# Altium project FlightController.PrjPcb (part 1 of 2)
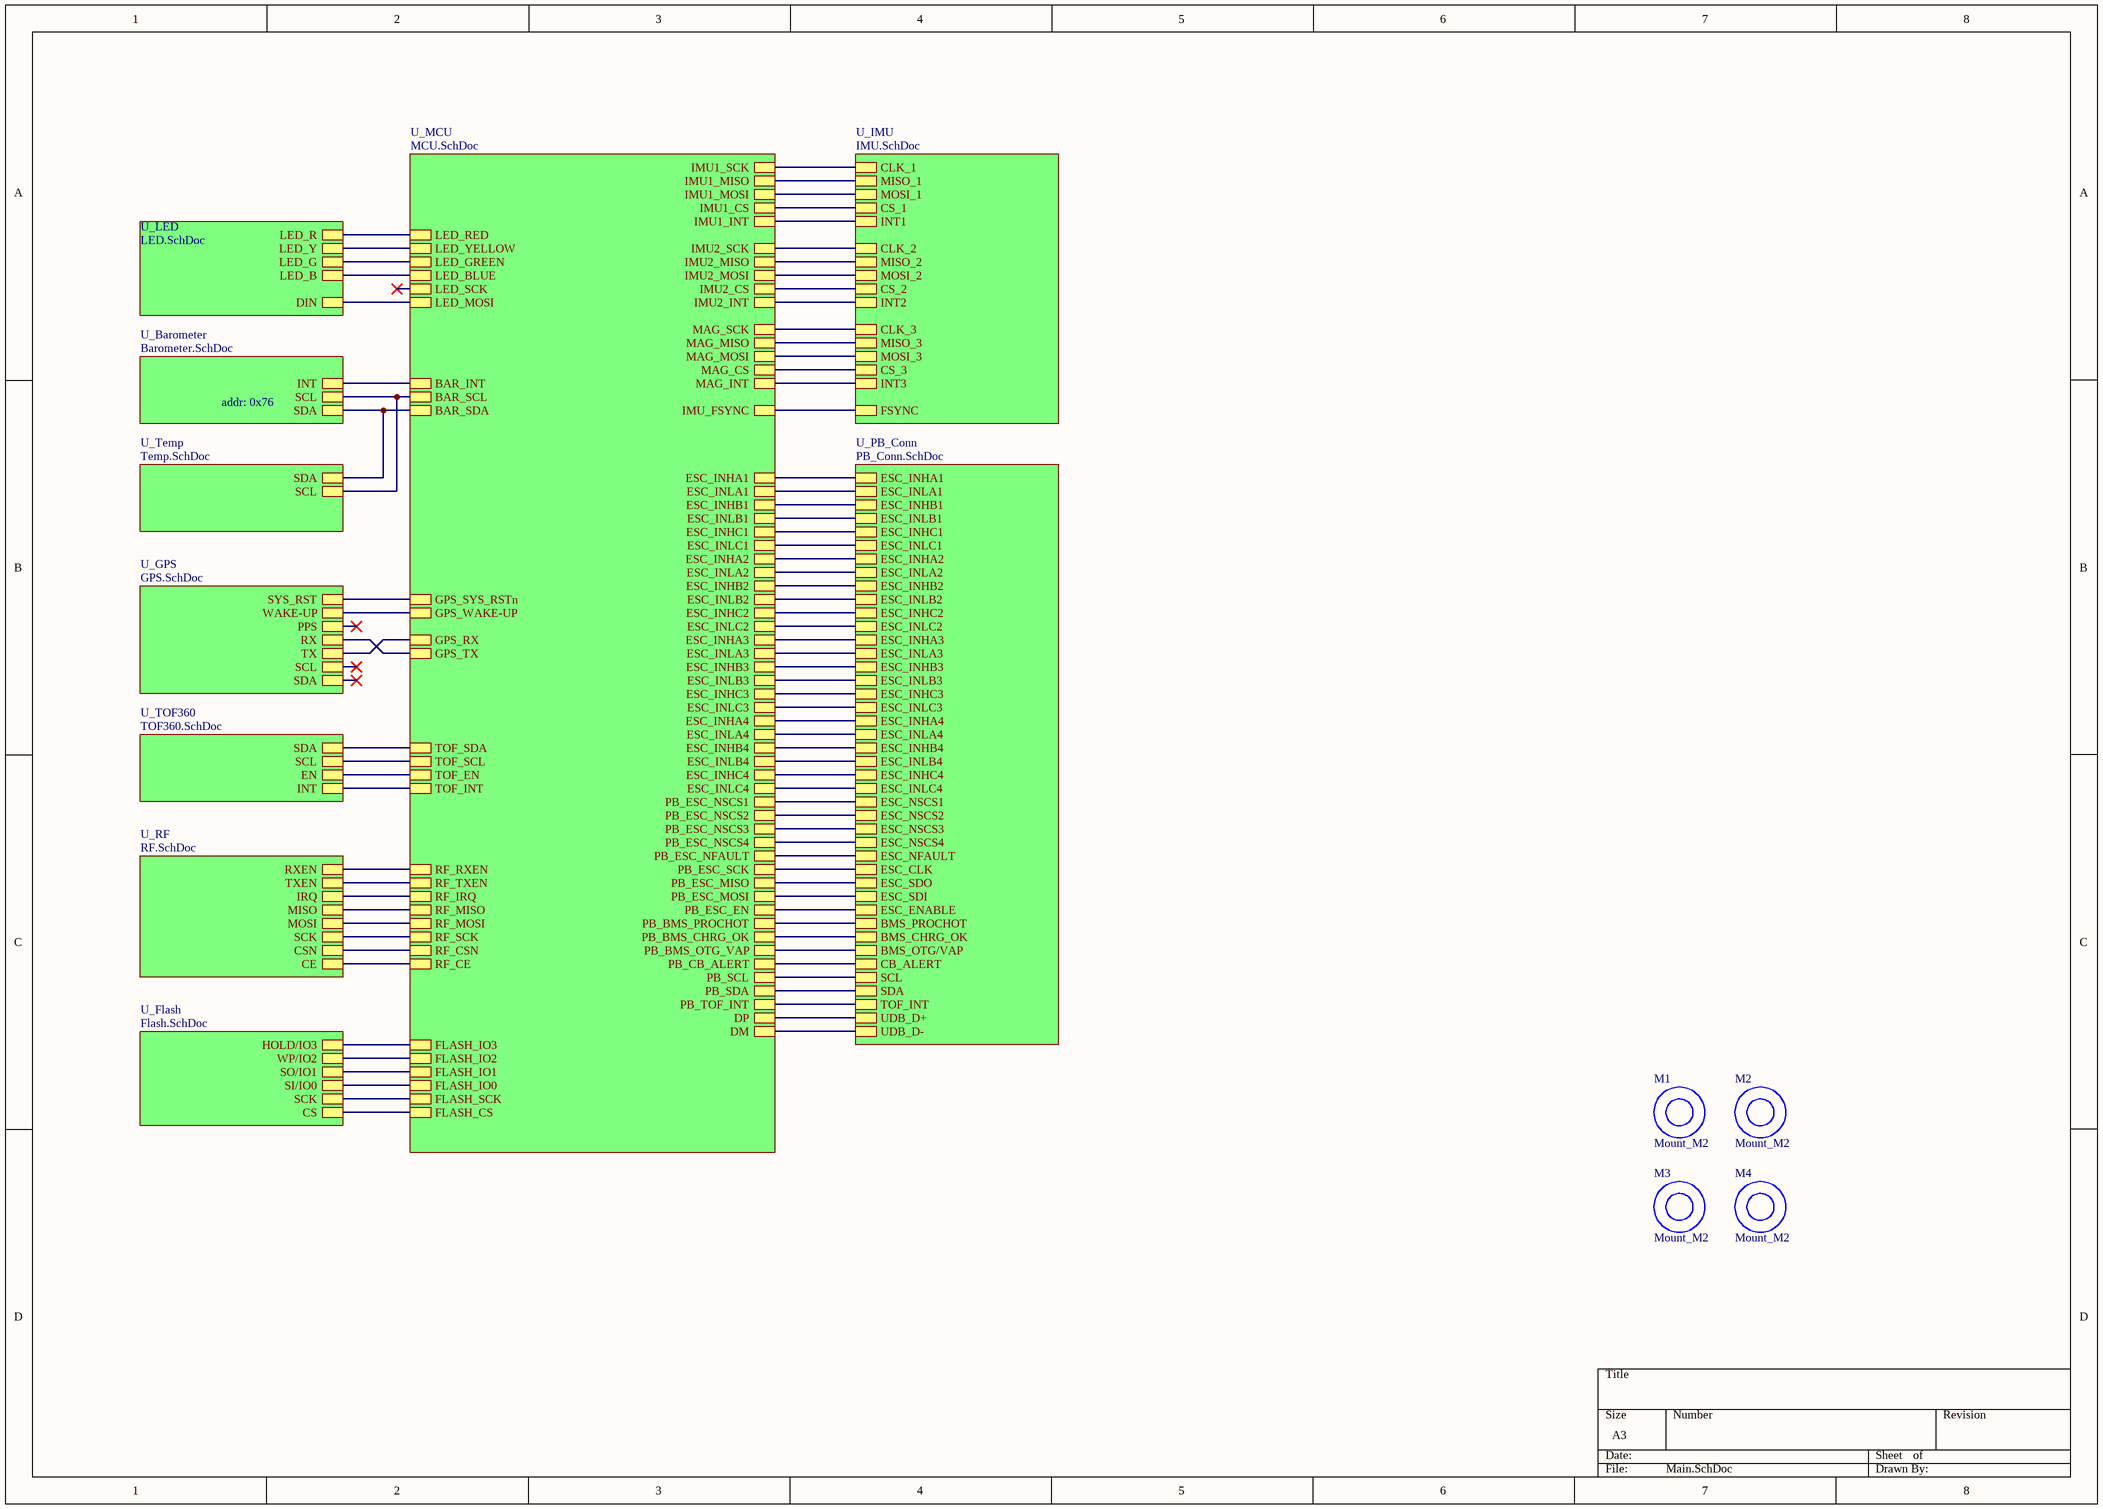
[diagram p0: Main.SchDoc]
11 sheets, 177 parts. Net scope: hierarchical (ports join the sheet entries above them; power ports are global).
Board file: PCB.PcbDoc
Sheets:
  Main.SchDoc
    U_MCU = MCU.SchDoc
    U_IMU = IMU.SchDoc
    U_Flash = Flash.SchDoc
    U_GPS = GPS.SchDoc
    U_Barometer = Barometer.SchDoc
    U_LED = LED.SchDoc
    U_PB_Conn = PB_Conn.SchDoc
      U_PSU = PSU.SchDoc
    U_Temp = Temp.SchDoc
  NRF24l01.SchDoc

## Sheet Main.SchDoc
size A3; SheetNumber: 1; SheetTotal: 13

### Parts
M1  Mount_M2  [Mount_M2_anti_vibration_rubber]
M2  Mount_M2  [Mount_M2_anti_vibration_rubber]
M3  Mount_M2  [Mount_M2_anti_vibration_rubber]
M4  Mount_M2  [Mount_M2_anti_vibration_rubber]

### Sub-sheets
U_Barometer = Barometer.SchDoc: SDA, SCL, INT
U_Flash = Flash.SchDoc: CS, SO/IO1, WP/IO2, HOLD/IO3, SCK, SI/IO0
U_GPS = GPS.SchDoc: SDA, SCL, TX, RX, PPS, WAKE-UP, SYS_RST
U_IMU = IMU.SchDoc: INT1, INT2, MISO_1, MOSI_1, CS_1, CLK_1, FSYNC, MISO_2, MOSI_2, CS_2, CLK_2, MOSI_3, CS_3, CLK_3, MISO_3, INT3
U_LED = LED.SchDoc: DIN, LED_R, LED_G, LED_Y, LED_B
U_MCU = MCU.SchDoc: DP, DM, TOF_SDA, TOF_SCL, TOF_EN, TOF_INT, ESC_INHA1, ESC_INHA2, ESC_INHA3, ESC_INHA4, ESC_INHB1, ESC_INHC1, ESC_INHB2, ESC_INHB3, ESC_INHB4, ESC_INHC2, ESC_INHC3, ESC_INHC4, ESC_INLA1, ESC_INLB1, ESC_INLC1, ESC_INLA2, ESC_INLA3, ESC_INLA4, ESC_INLB2, ESC_INLB3, ESC_INLB4, ESC_INLC2, ESC_INLC3, ESC_INLC4, RF_IRQ, RF_CSN, RF_MOSI, RF_MISO, RF_SCK, RF_CE, RF_RXEN, RF_TXEN, PB_SCL, PB_SDA, PB_TOF_INT, PB_ESC_EN, PB_ESC_SCK, PB_ESC_MISO, PB_ESC_MOSI, PB_ESC_NSCS1, PB_ESC_NSCS2, PB_ESC_NSCS3, PB_ESC_NSCS4, PB_BMS_PROCHOT, PB_BMS_OTG_VAP, PB_BMS_CHRG_OK, PB_CB_ALERT, PB_ESC_NFAULT, FLASH_IO0, FLASH_IO1, FLASH_IO2, FLASH_IO3, FLASH_SCK, FLASH_CS, GPS_RX, GPS_TX, GPS_WAKE-UP, GPS_SYS_RSTn, BAR_SCL, BAR_SDA, BAR_INT, LED_MOSI, LED_SCK, LED_RED, LED_GREEN, IMU1_SCK, IMU1_MISO, IMU1_MOSI, IMU1_CS, IMU1_INT, IMU2_INT, IMU2_SCK, IMU2_MISO, IMU2_MOSI, IMU2_CS, MAG_SCK, MAG_MISO, MAG_MOSI, MAG_CS, MAG_INT, IMU_FSYNC, LED_YELLOW, LED_BLUE
U_PB_Conn = PB_Conn.SchDoc: ESC_INLA1, ESC_INLB1, ESC_INLC1, ESC_INLA2, ESC_INLB2, ESC_INLC2, ESC_INLA3, ESC_INLB3, ESC_INLC3, ESC_INHA4, ESC_INLB4, ESC_INLC4, ESC_NSCS1, ESC_INHA1, ESC_INHB1, ESC_INHC1, ESC_INHA2, ESC_INHB2, ESC_INHC2, ESC_INHA3, ESC_INHB3, ESC_INHC3, ESC_INLA4, ESC_INHB4, ESC_INHC4, ESC_NSCS2, ESC_NSCS3, ESC_NSCS4, ESC_NFAULT, ESC_CLK, ESC_SDO, ESC_SDI, ESC_ENABLE, BMS_PROCHOT, BMS_CHRG_OK, BMS_OTG/VAP, CB_ALERT, SCL, SDA, TOF_INT, UDB_D+, UDB_D-
U_RF = RF.SchDoc (file not in this document): CE, CSN, SCK, MOSI, MISO, IRQ, TXEN, RXEN
U_Temp = Temp.SchDoc: SDA, SCL
U_TOF360 = TOF360.SchDoc (file not in this document): INT, SCL, SDA, EN

### Nets
I2C1_SCL: sheet U_MCU/TOF_SCL, sheet U_TOF360/SCL
I2C1_SDA: sheet U_MCU/TOF_SDA, sheet U_TOF360/SDA
SPI1_MISO: sheet U_MCU/IMU1_MISO, sheet U_IMU/MISO_1
SPI1_MOSI: sheet U_MCU/IMU1_MOSI, sheet U_IMU/MOSI_1
SPI1_SCK: sheet U_MCU/IMU1_SCK, sheet U_IMU/CLK_1
SPI5_MISO: sheet U_MCU/MAG_MISO, sheet U_IMU/MISO_3
SPI5_MOSI: sheet U_MCU/MAG_MOSI, sheet U_IMU/MOSI_3
SPI5_SCK: sheet U_MCU/MAG_SCK, sheet U_IMU/CLK_3
SPI6_MISO: sheet U_MCU/IMU2_MISO, sheet U_IMU/MISO_2
SPI6_MOSI: sheet U_MCU/IMU2_MOSI, sheet U_IMU/MOSI_2
SPI6_SCK: sheet U_MCU/IMU2_SCK, sheet U_IMU/CLK_2
TOF_EN: sheet U_MCU/TOF_EN, sheet U_TOF360/EN
TOF_INT: sheet U_MCU/TOF_INT, sheet U_TOF360/INT
NetC84_2: sheet U_MCU/GPS_TX, sheet U_GPS/RX
NetC85_2: sheet U_MCU/GPS_RX, sheet U_GPS/TX
NetD6_3: sheet U_MCU/LED_MOSI, sheet U_LED/DIN
NetIC1_4: sheet U_MCU/IMU1_INT, sheet U_IMU/INT1
NetIC1_9: sheet U_MCU/IMU_FSYNC, sheet U_IMU/FSYNC
NetIC1_12: sheet U_MCU/IMU1_CS, sheet U_IMU/CS_1
NetIC2_4: sheet U_MCU/IMU2_INT, sheet U_IMU/INT2
NetIC2_12: sheet U_MCU/IMU2_CS, sheet U_IMU/CS_2
NetIC3_1: sheet U_MCU/MAG_INT, sheet U_IMU/INT3
NetIC3_2: sheet U_MCU/MAG_CS, sheet U_IMU/CS_3
NetIC4_10: sheet U_MCU/ESC_INHC3, sheet U_PB_Conn/ESC_INHC3
NetIC4_11: sheet U_MCU/ESC_INHB3, sheet U_PB_Conn/ESC_INHB3
NetIC4_12: sheet U_MCU/ESC_INHA3, sheet U_PB_Conn/ESC_INHA3
NetIC4_28: sheet U_MCU/PB_ESC_MISO, sheet U_PB_Conn/ESC_SDO
NetIC4_29: sheet U_MCU/PB_ESC_MOSI, sheet U_PB_Conn/ESC_SDI
NetIC4_34: sheet U_MCU/ESC_INHC4, sheet U_PB_Conn/ESC_INHC4
NetIC4_35: sheet U_MCU/ESC_INHB4, sheet U_PB_Conn/ESC_INHB4
NetIC4_36: sheet U_MCU/ESC_INHA4, sheet U_PB_Conn/ESC_INHA4
NetIC4_37: sheet U_MCU/FLASH_IO2, sheet U_Flash/WP/IO2
NetIC4_42: sheet U_MCU/FLASH_IO3, sheet U_Flash/HOLD/IO3
NetIC4_45: sheet U_MCU/PB_ESC_NFAULT, sheet U_PB_Conn/ESC_NFAULT
NetIC4_46: sheet U_MCU/FLASH_IO1, sheet U_Flash/SO/IO1
NetIC4_47: sheet U_MCU/FLASH_IO0, sheet U_Flash/SI/IO0
NetIC4_48: sheet U_MCU/FLASH_SCK, sheet U_Flash/SCK
NetIC4_49: sheet U_MCU/GPS_SYS_RSTn, sheet U_GPS/SYS_RST
NetIC4_50: sheet U_MCU/GPS_WAKE-UP, sheet U_GPS/WAKE-UP
NetIC4_53: sheet U_MCU/PB_ESC_EN, sheet U_PB_Conn/ESC_ENABLE
NetIC4_54: sheet U_MCU/BAR_SCL, sheet U_Barometer/SCL, sheet U_Temp/SCL
NetIC4_55: sheet U_MCU/BAR_SDA, sheet U_Barometer/SDA, sheet U_Temp/SDA
NetIC4_58: sheet U_MCU/PB_ESC_NSCS4, sheet U_PB_Conn/ESC_NSCS4
NetIC4_59: sheet U_MCU/ESC_INLA4, sheet U_PB_Conn/ESC_INLA4
NetIC4_60: sheet U_MCU/ESC_INLB4, sheet U_PB_Conn/ESC_INLB4
NetIC4_63: sheet U_MCU/ESC_INLC4, sheet U_PB_Conn/ESC_INLC4
NetIC4_64: sheet U_MCU/FLASH_CS, sheet U_Flash/CS
NetIC4_65: sheet U_MCU/PB_ESC_NSCS3, sheet U_PB_Conn/ESC_NSCS3
NetIC4_66: sheet U_MCU/ESC_INLA3, sheet U_PB_Conn/ESC_INLA3
NetIC4_67: sheet U_MCU/ESC_INLB3, sheet U_PB_Conn/ESC_INLB3
NetIC4_68: sheet U_MCU/ESC_INLC3, sheet U_PB_Conn/ESC_INLC3
NetIC4_69: sheet U_MCU/PB_SCL, sheet U_PB_Conn/SCL
NetIC4_70: sheet U_MCU/PB_SDA, sheet U_PB_Conn/SDA
NetIC4_73: sheet U_MCU/PB_ESC_NSCS1, sheet U_PB_Conn/ESC_NSCS1
NetIC4_74: sheet U_MCU/PB_ESC_SCK, sheet U_PB_Conn/ESC_CLK
NetIC4_75: sheet U_MCU/BAR_INT, sheet U_Barometer/INT
NetIC4_76: sheet U_MCU/ESC_INLA1, sheet U_PB_Conn/ESC_INLA1
NetIC4_77: sheet U_MCU/ESC_INLB1, sheet U_PB_Conn/ESC_INLB1
NetIC4_78: sheet U_MCU/PB_BMS_OTG_VAP, sheet U_PB_Conn/BMS_OTG/VAP
NetIC4_79: sheet U_MCU/ESC_INLC1, sheet U_PB_Conn/ESC_INLC1
NetIC4_80: sheet U_MCU/PB_ESC_NSCS2, sheet U_PB_Conn/ESC_NSCS2
NetIC4_81: sheet U_MCU/ESC_INHC1, sheet U_PB_Conn/ESC_INHC1
NetIC4_82: sheet U_MCU/ESC_INHB1, sheet U_PB_Conn/ESC_INHB1
NetIC4_85: sheet U_MCU/ESC_INHA1, sheet U_PB_Conn/ESC_INHA1
NetIC4_86: sheet U_MCU/PB_BMS_PROCHOT, sheet U_PB_Conn/BMS_PROCHOT
NetIC4_87: sheet U_MCU/PB_TOF_INT, sheet U_PB_Conn/TOF_INT
NetIC4_88: sheet U_MCU/ESC_INLC2, sheet U_PB_Conn/ESC_INLC2
NetIC4_89: sheet U_MCU/ESC_INLB2, sheet U_PB_Conn/ESC_INLB2
NetIC4_90: sheet U_MCU/ESC_INLA2, sheet U_PB_Conn/ESC_INLA2
NetIC4_92: sheet U_MCU/PB_BMS_CHRG_OK, sheet U_PB_Conn/BMS_CHRG_OK
NetIC4_93: sheet U_MCU/PB_CB_ALERT, sheet U_PB_Conn/CB_ALERT
NetIC4_96: sheet U_MCU/ESC_INHA2, sheet U_PB_Conn/ESC_INHA2
NetIC4_97: sheet U_MCU/ESC_INHB2, sheet U_PB_Conn/ESC_INHB2
NetIC4_98: sheet U_MCU/ESC_INHC2, sheet U_PB_Conn/ESC_INHC2
NetIC4_99: sheet U_MCU/LED_BLUE, sheet U_LED/LED_B
NetIC4_100: sheet U_MCU/LED_GREEN, sheet U_LED/LED_G
NetIC4_101: sheet U_MCU/LED_YELLOW, sheet U_LED/LED_Y
NetIC4_102: sheet U_MCU/LED_RED, sheet U_LED/LED_R
NetIC4_103: sheet U_MCU/DM, sheet U_PB_Conn/UDB_D-
NetIC4_104: sheet U_MCU/DP, sheet U_PB_Conn/UDB_D+
NetIC4_110: sheet U_MCU/RF_CE, sheet U_RF/CE
NetIC4_111: sheet U_MCU/RF_SCK, sheet U_RF/SCK
NetIC4_112: sheet U_MCU/RF_MISO, sheet U_RF/MISO
NetIC4_113: sheet U_MCU/RF_MOSI, sheet U_RF/MOSI
NetIC4_114: sheet U_MCU/RF_CSN, sheet U_RF/CSN
NetIC4_115: sheet U_MCU/RF_IRQ, sheet U_RF/IRQ
NetIC4_116: sheet U_MCU/RF_TXEN, sheet U_RF/TXEN
NetIC4_118: sheet U_MCU/RF_RXEN, sheet U_RF/RXEN

### Notes on the sheet
- addr: 0x76

## Sheet MCU.SchDoc
size A2; SheetNumber: 3; SheetTotal: 13
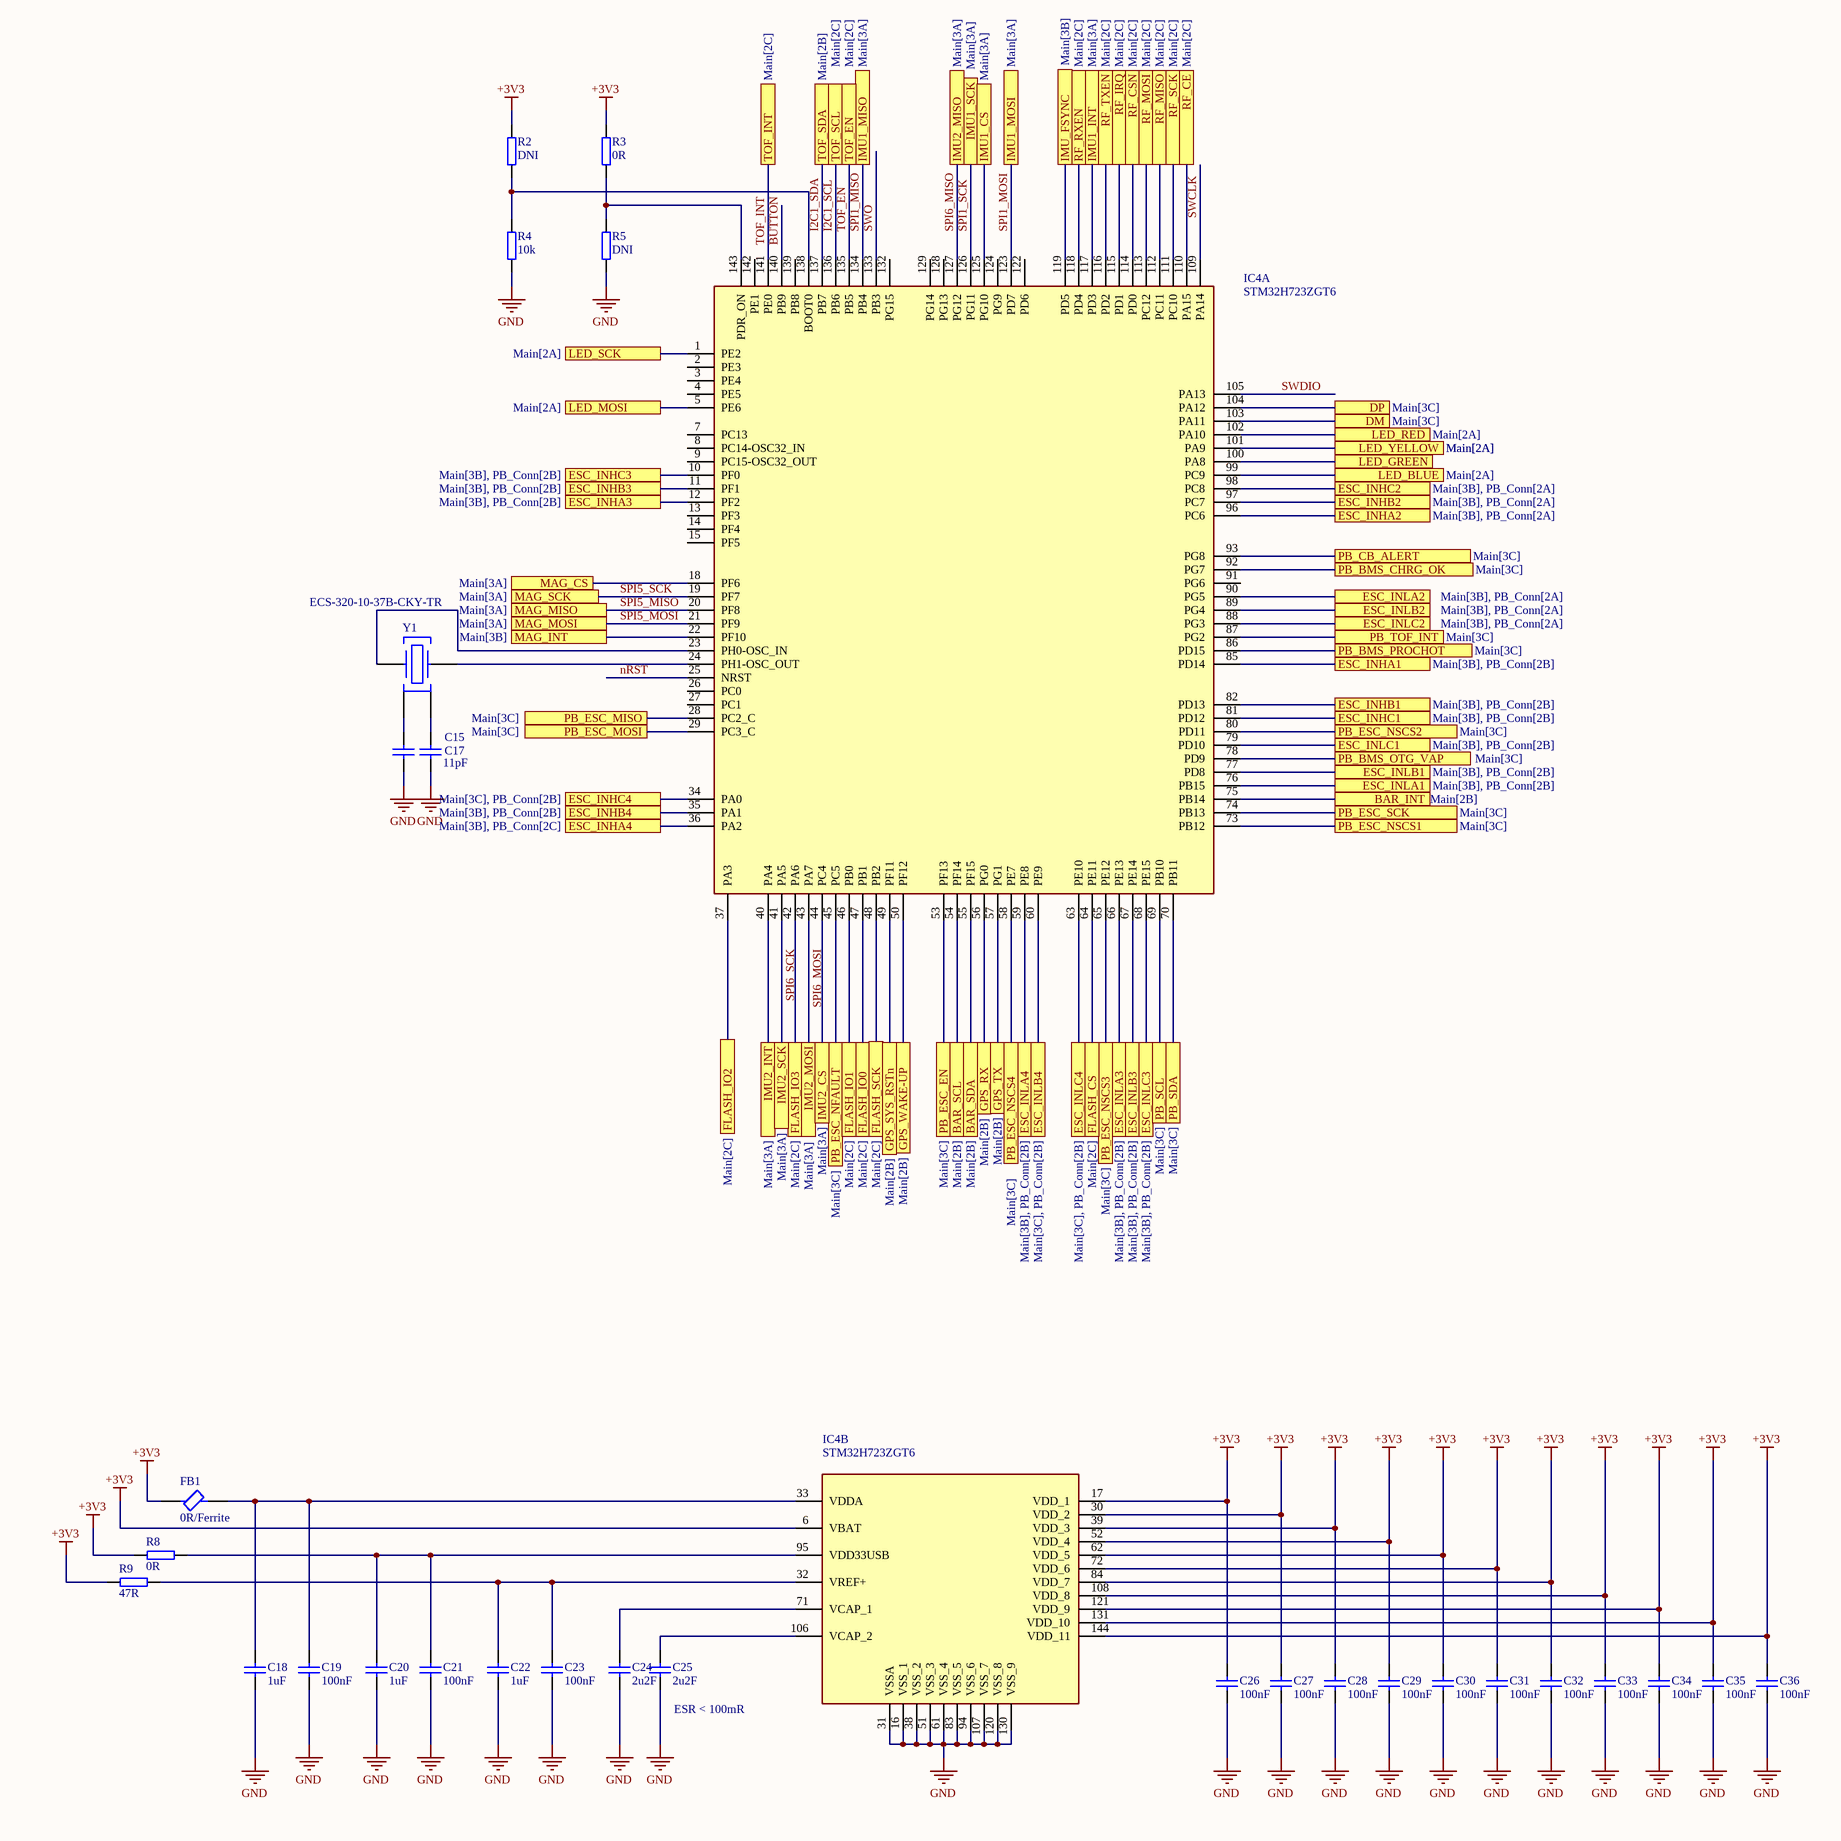
[diagram p1: MCU.SchDoc, left]
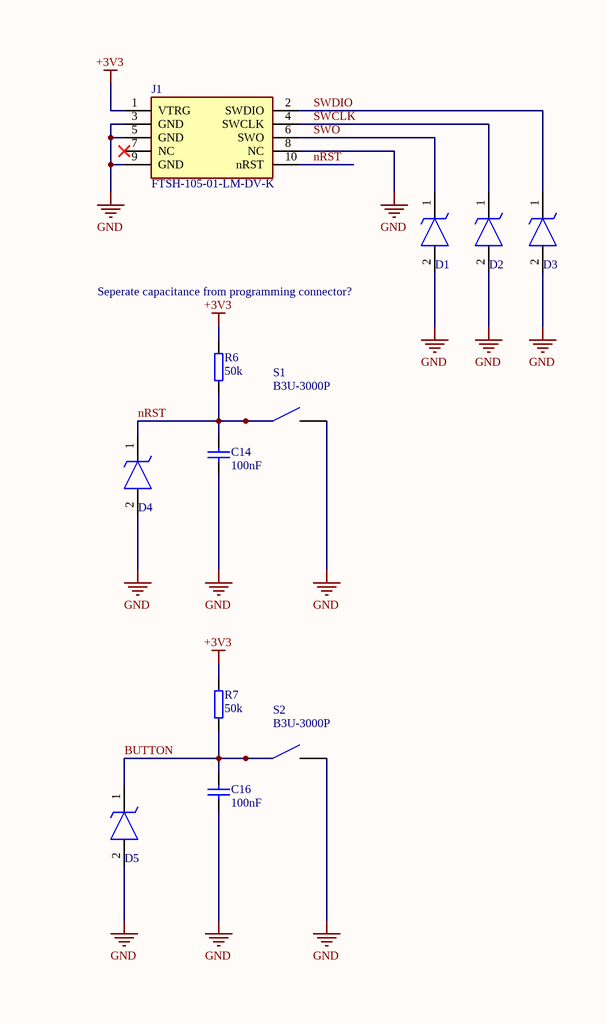
[diagram p2: MCU.SchDoc, right]

### Parts
C14  value 100nF  [CAP0402]  (hidden comment: Cap0402)
C15  Cap0402  [CAP0402]  (value not drawn)
C16  value 100nF  [CAP0402]  (hidden comment: Cap0402)
C17  value 11pF  [CAP0402]  (hidden comment: Cap0402)
C18  value 1uF  [CAP0603]  (hidden comment: Cap0603)
C19  value 100nF  [CAP0402]  (hidden comment: Cap0402)
C20  value 1uF  [CAP0603]  (hidden comment: Cap0603)
C21  value 100nF  [CAP0402]  (hidden comment: Cap0402)
C22  value 1uF  [CAP0603]  (hidden comment: Cap0603)
C23  value 100nF  [CAP0402]  (hidden comment: Cap0402)
C24  value 2u2F  [CAP0603]  (hidden comment: Cap0603)
C25  value 2u2F  [CAP0603]  (hidden comment: Cap0603)
C26  value 100nF  [CAP0402]  (hidden comment: Cap0402)
C27  value 100nF  [CAP0402]  (hidden comment: Cap0402)
C28  value 100nF  [CAP0402]  (hidden comment: Cap0402)
C29  value 100nF  [CAP0402]  (hidden comment: Cap0402)
C30  value 100nF  [CAP0402]  (hidden comment: Cap0402)
C31  value 100nF  [CAP0402]  (hidden comment: Cap0402)
C32  value 100nF  [CAP0402]  (hidden comment: Cap0402)
C33  value 100nF  [CAP0402]  (hidden comment: Cap0402)
C34  value 100nF  [CAP0402]  (hidden comment: Cap0402)
C35  value 100nF  [CAP0402]  (hidden comment: Cap0402)
C36  value 100nF  [CAP0402]  (hidden comment: Cap0402)
D1  D1213A-01LP4-7B  [D1213A01LP47B]  (value not drawn)
D2  D1213A-01LP4-7B  [D1213A01LP47B]  (value not drawn)
D3  D1213A-01LP4-7B  [D1213A01LP47B]  (value not drawn)
D4  D1213A-01LP4-7B  [D1213A01LP47B]  (value not drawn)
D5  D1213A-01LP4-7B  [D1213A01LP47B]  (value not drawn)
FB1  0R/Ferrite  [NFZ15SG152SN10B]
IC4  STM32H723ZGT6  [QFP50P2200X2200X160-144N]  (parts A,B of 2)
J1  FTSH-105-01-LM-DV-K  [FTSH-105-XX-YYY-DV-K]
R2  value DNI  [RES0402]  (hidden comment: Res0402)
R3  value 0R  [RES0402]  (hidden comment: Res0402)
R4  value 10k  [RES0402]  (hidden comment: Res0402)
R5  value DNI  [RES0402]  (hidden comment: Res0402)
R6  value 50k  [RES0402]  (hidden comment: Res0402)
R7  value 50k  [RES0402]  (hidden comment: Res0402)
R8  value 0R  [RES0402]  (hidden comment: Res0402)
R9  value 47R  [RES0402]  (hidden comment: Res0402)
S1  B3U-3000P  [B3U-1000P]
S2  B3U-3000P  [B3U-1000P]
Y1  ECS-320-10-37B-CKY-TR  [ECS3201037BCKYTR]

### Ports
BAR_INT (see Main[2B]), BAR_SCL (see Main[2B]), BAR_SDA (see Main[2B]), DM (see Main[3C]), DP (see Main[3C]), ESC_INHA1 (see Main[3B], PB_Conn[2B]), ESC_INHA2 (see Main[3B], PB_Conn[2A]), ESC_INHA3 (see Main[3B], PB_Conn[2B]), ESC_INHA4 (see Main[3B], PB_Conn[2C]), ESC_INHB1 (see Main[3B], PB_Conn[2B]), ESC_INHB2 (see Main[3B], PB_Conn[2A]), ESC_INHB3 (see Main[3B], PB_Conn[2B]), ESC_INHB4 (see Main[3B], PB_Conn[2B]), ESC_INHC1 (see Main[3B], PB_Conn[2B]), ESC_INHC2 (see Main[3B], PB_Conn[2A]), ESC_INHC3 (see Main[3B], PB_Conn[2B]), ESC_INHC4 (see Main[3C], PB_Conn[2B]), ESC_INLA1 (see Main[3B], PB_Conn[2B]), ESC_INLA2 (see Main[3B], PB_Conn[2A]), ESC_INLA3 (see Main[3B], PB_Conn[2B]), ESC_INLA4 (see Main[3B], PB_Conn[2B]), ESC_INLB1 (see Main[3B], PB_Conn[2B]), ESC_INLB2 (see Main[3B], PB_Conn[2A]), ESC_INLB3 (see Main[3B], PB_Conn[2B]), ESC_INLB4 (see Main[3C], PB_Conn[2B]), ESC_INLC1 (see Main[3B], PB_Conn[2B]), ESC_INLC2 (see Main[3B], PB_Conn[2A]), ESC_INLC3 (see Main[3B], PB_Conn[2B]), ESC_INLC4 (see Main[3C], PB_Conn[2B]), FLASH_CS (see Main[2C]), FLASH_IO0 (see Main[2C]), FLASH_IO1 (see Main[2C]), FLASH_IO2 (see Main[2C]), FLASH_IO3 (see Main[2C]), FLASH_SCK (see Main[2C]), GPS_RX (see Main[2B]), GPS_SYS_RSTn (see Main[2B]), GPS_TX (see Main[2B]), GPS_WAKE-UP (see Main[2B]), IMU1_CS (see Main[3A]), IMU1_INT (see Main[3A]), IMU1_MISO (see Main[3A]), IMU1_MOSI (see Main[3A]), IMU1_SCK (see Main[3A]), IMU2_CS (see Main[3A]), IMU2_INT (see Main[3A]), IMU2_MISO (see Main[3A]), IMU2_MOSI (see Main[3A]), IMU2_SCK (see Main[3A]), IMU_FSYNC (see Main[3B]), LED_BLUE (see Main[2A]), LED_GREEN (see Main[2A]), LED_MOSI (see Main[2A]), LED_RED (see Main[2A]), LED_SCK (see Main[2A]), LED_YELLOW (see Main[2A]), MAG_CS (see Main[3A]), MAG_INT (see Main[3B]), MAG_MISO (see Main[3A]), MAG_MOSI (see Main[3A]), MAG_SCK (see Main[3A]), PB_BMS_CHRG_OK (see Main[3C]), PB_BMS_OTG_VAP (see Main[3C]), PB_BMS_PROCHOT (see Main[3C]), PB_CB_ALERT (see Main[3C]), PB_ESC_EN (see Main[3C]), PB_ESC_MISO (see Main[3C]), PB_ESC_MOSI (see Main[3C]), PB_ESC_NFAULT (see Main[3C]), PB_ESC_NSCS1 (see Main[3C]), PB_ESC_NSCS2 (see Main[3C]), PB_ESC_NSCS3 (see Main[3C]), PB_ESC_NSCS4 (see Main[3C]), PB_ESC_SCK (see Main[3C]), PB_SCL (see Main[3C]), PB_SDA (see Main[3C]), PB_TOF_INT (see Main[3C]), RF_CE (see Main[2C]), RF_CSN (see Main[2C]), RF_IRQ (see Main[2C]), RF_MISO (see Main[2C]), RF_MOSI (see Main[2C]), RF_RXEN (see Main[2C]), RF_SCK (see Main[2C]), RF_TXEN (see Main[2C]), TOF_EN (see Main[2C]), TOF_INT (see Main[2C]), TOF_SCL (see Main[2C]), TOF_SDA (see Main[2B])

### Nets
+3V3: C26.2 C27.2 C28.2 C29.2 C30.2 C31.2 C32.2 C33.2 C34.2 C35.2 C36.2 FB1.1 IC4.6(VBAT) IC4.17(VDD_1) IC4.30(VDD_2) IC4.39(VDD_3) IC4.52(VDD_4) IC4.62(VDD_5) IC4.72(VDD_6) IC4.84(VDD_7) IC4.108(VDD_8) IC4.121(VDD_9) IC4.131(VDD_10) IC4.144(VDD_11) J1.1(VTRG) R2.2 R3.2 R6.2 R7.2 R8.1 R9.1
GND: C14.1 C15.1 C16.1 C17.1 C18.1 C19.1 C20.1 C21.1 C22.1 C23.1 C24.1 C25.1 C26.1 C27.1 C28.1 C29.1 C30.1 C31.1 C32.1 C33.1 C34.1 C35.1 C36.1 D1.2(A) D2.2(A) D3.2(A) D4.2(A) D5.2(A) IC4.16(VSS_1) IC4.31(VSSA) IC4.38(VSS_2) IC4.51(VSS_3) IC4.61(VSS_4) IC4.83(VSS_5) IC4.94(VSS_6) IC4.107(VSS_7) IC4.120(VSS_8) IC4.130(VSS_9) J1.3(GND) J1.5(GND) J1.8(NC) J1.9(GND) R4.1 R5.1 S1.1 S2.1
BUTTON: C16.2 D5.1(K) IC4.140(PB9) R7.1 S2.2
I2C1_SCL: IC4.136(PB6) ; port TOF_SCL
I2C1_SDA: IC4.137(PB7) ; port TOF_SDA
nRST: C14.2 D4.1(K) IC4.25(NRST) J1.10(nRST) R6.1 S1.2
SPI1_MISO: IC4.134(PB4) ; port IMU1_MISO
SPI1_MOSI: IC4.123(PD7) ; port IMU1_MOSI
SPI1_SCK: IC4.126(PG11) ; port IMU1_SCK
SPI5_MISO: IC4.20(PF8) ; port MAG_MISO
SPI5_MOSI: IC4.21(PF9) ; port MAG_MOSI
SPI5_SCK: IC4.19(PF7) ; port MAG_SCK
SPI6_MISO: IC4.127(PG12) ; port IMU2_MISO
SPI6_MOSI: IC4.43(PA7) ; port IMU2_MOSI
SPI6_SCK: IC4.41(PA5) ; port IMU2_SCK
SWCLK: D2.1(K) IC4.109(PA14) J1.4(SWCLK)
SWDIO: D3.1(K) IC4.105(PA13) J1.2(SWDIO)
SWO: D1.1(K) IC4.133(PB3) J1.6(SWO)
TOF_EN: IC4.135(PB5) ; port TOF_EN
TOF_INT: IC4.141(PE0) ; port TOF_INT
NetC15_2: C15.2 Y1.4(GND_2)
NetC17_2: C17.2 Y1.2(GND_1)
NetC18_2: C18.2 C19.2 FB1.2 IC4.33(VDDA)
NetC20_2: C20.2 C21.2 IC4.95(VDD33USB) R8.2
NetC22_2: C22.2 C23.2 IC4.32(VREF+) R9.2
NetC24_2: C24.2 IC4.71(VCAP_1)
NetC25_2: C25.2 IC4.106(VCAP_2)
NetC84_2: IC4.57(PG1) ; port GPS_TX
NetC85_2: IC4.56(PG0) ; port GPS_RX
NetD6_3: IC4.5(PE6) ; port LED_MOSI
NetIC1_4: IC4.117(PD3) ; port IMU1_INT
NetIC1_9: IC4.119(PD5) ; port IMU_FSYNC
NetIC1_12: IC4.125(PG10) ; port IMU1_CS
NetIC2_4: IC4.40(PA4) ; port IMU2_INT
NetIC2_12: IC4.44(PC4) ; port IMU2_CS
NetIC3_1: IC4.22(PF10) ; port MAG_INT
NetIC3_2: IC4.18(PF6) ; port MAG_CS
NetIC4_1: IC4.1(PE2) ; port LED_SCK
NetIC4_10: IC4.10(PF0) ; port ESC_INHC3
NetIC4_11: IC4.11(PF1) ; port ESC_INHB3
NetIC4_12: IC4.12(PF2) ; port ESC_INHA3
NetIC4_23: IC4.23(PH0-OSC_IN) Y1.1(CRYSTAL_1)
NetIC4_24: IC4.24(PH1-OSC_OUT) Y1.3(CRYSTAL_2)
NetIC4_28: IC4.28(PC2_C) ; port PB_ESC_MISO
NetIC4_29: IC4.29(PC3_C) ; port PB_ESC_MOSI
NetIC4_34: IC4.34(PA0) ; port ESC_INHC4
NetIC4_35: IC4.35(PA1) ; port ESC_INHB4
NetIC4_36: IC4.36(PA2) ; port ESC_INHA4
NetIC4_37: IC4.37(PA3) ; port FLASH_IO2
NetIC4_42: IC4.42(PA6) ; port FLASH_IO3
NetIC4_45: IC4.45(PC5) ; port PB_ESC_NFAULT
NetIC4_46: IC4.46(PB0) ; port FLASH_IO1
NetIC4_47: IC4.47(PB1) ; port FLASH_IO0
NetIC4_48: IC4.48(PB2) ; port FLASH_SCK
NetIC4_49: IC4.49(PF11) ; port GPS_SYS_RSTn
NetIC4_50: IC4.50(PF12) ; port GPS_WAKE-UP
NetIC4_53: IC4.53(PF13) ; port PB_ESC_EN
NetIC4_54: IC4.54(PF14) ; port BAR_SCL
NetIC4_55: IC4.55(PF15) ; port BAR_SDA
NetIC4_58: IC4.58(PE7) ; port PB_ESC_NSCS4
NetIC4_59: IC4.59(PE8) ; port ESC_INLA4
NetIC4_60: IC4.60(PE9) ; port ESC_INLB4
NetIC4_63: IC4.63(PE10) ; port ESC_INLC4
NetIC4_64: IC4.64(PE11) ; port FLASH_CS
NetIC4_65: IC4.65(PE12) ; port PB_ESC_NSCS3
NetIC4_66: IC4.66(PE13) ; port ESC_INLA3
NetIC4_67: IC4.67(PE14) ; port ESC_INLB3
NetIC4_68: IC4.68(PE15) ; port ESC_INLC3
NetIC4_69: IC4.69(PB10) ; port PB_SCL
NetIC4_70: IC4.70(PB11) ; port PB_SDA
NetIC4_73: IC4.73(PB12) ; port PB_ESC_NSCS1
NetIC4_74: IC4.74(PB13) ; port PB_ESC_SCK
NetIC4_75: IC4.75(PB14) ; port BAR_INT
NetIC4_76: IC4.76(PB15) ; port ESC_INLA1
NetIC4_77: IC4.77(PD8) ; port ESC_INLB1
NetIC4_78: IC4.78(PD9) ; port PB_BMS_OTG_VAP
NetIC4_79: IC4.79(PD10) ; port ESC_INLC1
NetIC4_80: IC4.80(PD11) ; port PB_ESC_NSCS2
NetIC4_81: IC4.81(PD12) ; port ESC_INHC1
NetIC4_82: IC4.82(PD13) ; port ESC_INHB1
NetIC4_85: IC4.85(PD14) ; port ESC_INHA1
NetIC4_86: IC4.86(PD15) ; port PB_BMS_PROCHOT
NetIC4_87: IC4.87(PG2) ; port PB_TOF_INT
NetIC4_88: IC4.88(PG3) ; port ESC_INLC2
NetIC4_89: IC4.89(PG4) ; port ESC_INLB2
NetIC4_90: IC4.90(PG5) ; port ESC_INLA2
NetIC4_92: IC4.92(PG7) ; port PB_BMS_CHRG_OK
NetIC4_93: IC4.93(PG8) ; port PB_CB_ALERT
NetIC4_96: IC4.96(PC6) ; port ESC_INHA2
NetIC4_97: IC4.97(PC7) ; port ESC_INHB2
NetIC4_98: IC4.98(PC8) ; port ESC_INHC2
NetIC4_99: IC4.99(PC9) ; port LED_BLUE
NetIC4_100: IC4.100(PA8) ; port LED_GREEN
NetIC4_101: IC4.101(PA9) ; port LED_YELLOW
NetIC4_102: IC4.102(PA10) ; port LED_RED
NetIC4_103: IC4.103(PA11) ; port DM
NetIC4_104: IC4.104(PA12) ; port DP
NetIC4_110: IC4.110(PA15) ; port RF_CE
NetIC4_111: IC4.111(PC10) ; port RF_SCK
NetIC4_112: IC4.112(PC11) ; port RF_MISO
NetIC4_113: IC4.113(PC12) ; port RF_MOSI
NetIC4_114: IC4.114(PD0) ; port RF_CSN
NetIC4_115: IC4.115(PD1) ; port RF_IRQ
NetIC4_116: IC4.116(PD2) ; port RF_TXEN
NetIC4_118: IC4.118(PD4) ; port RF_RXEN
NetIC4_138: IC4.138(BOOT0) R2.1 R4.2
NetIC4_143: IC4.143(PDR_ON) R3.1 R5.2

Not connected (* = marked no-connect by the designer): IC4 2(PE3) 3(PE4) 4(PE5) 7(PC13) 8(PC14-OSC32_IN) 9(PC15-OSC32_OUT) 13(PF3) 14(PF4) 15(PF5) 26(PC0) 27(PC1) 91(PG6) 122(PD6) 124(PG9) 128(PG13) 129(PG14) 132(PG15) 139(PB8) 142(PE1); J1 7(NC)*

### Notes on the sheet
- Seperate capacitance from programming connector?
- (near C25) ESR < 100mR

### Library data of the parts
C14 C16 C19 C21 C23 C26-C36 = Cap0402: Manufacturer_Part_Number: GRM155R71H104ME14D; Voltage: 50V
C15 = Cap0402: Manufacturer_Part_Number: GCM1555C1H110JA16D; Voltage: 50V; Value: 11pF
C17 = Cap0402: Manufacturer_Part_Number: GCM1555C1H110JA16D; Voltage: 50V
C18 C20 C22 = Cap0603: Manufacturer_Part_Number: GRT188R61H105KE13D; Voltage: 50V
C24 C25 = Cap0603: Manufacturer_Part_Number: GRT188R61H225KE13D; Voltage: 50V
D1-D5 = D1213A-01LP4-7B: TVS Diode (Uni-directional); Manufacturer_Name: Diodes Incorporated; Datasheet Link: https://www.diodes.com/assets/Datasheets/D1213A-01LP4.pdf; Height: 0.4mm; Manufacturer_Part_Number: D1213A-01LP4-7B; Mouser Part Number: 621-D1213A-01LP4-7B; Mouser Price/Stock: https://www.mouser.co.uk/ProductDetail/Diodes-Incorporated/D1213A-01LP4-7B?qs=gfe7vQ8txpVKfG5NOSOvfA%3D%3D; Arrow Part Number: D1213A-01LP4-7B; Arrow Price/Stock: https://www.arrow.com/en/products/d1213a-01lp4-7b/diodes-incorporated?region=europe
FB1 = BLM15PE471SH1D: Ferrite Bead; Manufacturer_Name: Murata Electronics; Datasheet Link: https://www.murata.com/en-global/products/productdetail.aspx?cate=luNoiseSupprFilteChipFerriBead&partno=BLM15PE471SH1%23; Height: 0.55mm; Manufacturer_Part_Number: BLM15PE471SH1D; Mouser Part Number: 81-BLM15PE471SH1D; Mouser Price/Stock: https://www.mouser.co.uk/ProductDetail/Murata-Electronics/BLM15PE471SH1D?qs=DRkmTr78QATAY5qAVx1hGA%3D%3D
IC4 = STM32H723ZGT6: Integrated Circuit; Manufacturer_Name: STMicroelectronics; Datasheet Link: https://www.mouser.cn/datasheet/2/389/stm32h723zg-1893346.pdf; Height: 1.6mm; Manufacturer_Part_Number: STM32H723ZGT6; Mouser Part Number: 511-STM32H723ZGT6; Mouser Price/Stock: https://www.mouser.co.uk/ProductDetail/STMicroelectronics/STM32H723ZGT6?qs=sPbYRqrBIVkPaOxQT7wG%252BA%3D%3D; Arrow Part Number: STM32H723ZGT6; Arrow Price/Stock: https://www.arrow.com/en/products/stm32h723zgt6/stmicroelectronics?region=nac
J1 = FTSH-105-01-LM-DV-K: Connector; Manufacturer_Name: SAMTEC; Datasheet Link: http://suddendocs.samtec.com/prints/ftsh-1xx-xx-xxx-dv-xxx-xxx-mkt.pdf; Manufacturer_Part_Number: FTSH-105-01-LM-DV-K; Mouser Part Number: 200-FTSH10501LMDVK; Mouser Price/Stock: https://www.mouser.co.uk/ProductDetail/Samtec/FTSH-105-01-LM-DV-K?qs=Cqqh%252BS766wkgt1n7b4Yb6g%3D%3D; Arrow Part Number: FTSH-105-01-LM-DV-K; Arrow Price/Stock: https://www.arrow.com/en/products/ftsh-105-01-lm-dv-k/samtec?utm_currency=USD&region=nac
R3 R8 = Res0402: Manufacturer_Part_Number: RCA04020000ZSED
R4 = Res0402: Manufacturer_Part_Number: ERA-2AED103X
R6 R7 = Res0402: Manufacturer_Part_Number: TNPW040249K9DEED
R9 = Res0402: Manufacturer_Part_Number: CRGCQ0402J47R
S1 S2 = B3U-3000P: Switch; Manufacturer_Name: Omron Electronics; Datasheet Link: http://omronfs.omron.com/en_US/ecb/products/pdf/en-b3u.pdf; Manufacturer_Part_Number: B3U-3000P; Mouser Part Number: 653-B3U-3000P; Mouser Price/Stock: https://www.mouser.co.uk/ProductDetail/Omron-Electronics/B3U-3000P?qs=AO7BQMcsEu4un9I7hS23xg%3D%3D; Arrow Part Number: B3U-3000P; Arrow Price/Stock: https://www.arrow.com/en/products/b3u-3000p/omron?region=nac
Y1 = ECS-320-10-37B-CKY-TR: Crystal or Oscillator; Manufacturer_Name: ECS; Datasheet Link: https://ecsxtal.com/store/pdf/ECX-1637B.pdf; Height: 0.5mm; Manufacturer_Part_Number: ECS-320-10-37B-CKY-TR; Mouser Part Number: 520-320-10-37B-CKYT; Mouser Price/Stock: https://www.mouser.co.uk/ProductDetail/ECS/ECS-320-10-37B-CKY-TR?qs=l7cgNqFNU1gltxVt%2FwcX%252Bw%3D%3D; Arrow Part Number: ECS-320-10-37B-CKY-TR; Arrow Price/Stock: https://www.arrow.com/en/products/ecs-320-10-37b-cky-tr/ecs-international?region=nac

## Sheet IMU.SchDoc
size A2 portrait; SheetNumber: 2; SheetTotal: 13
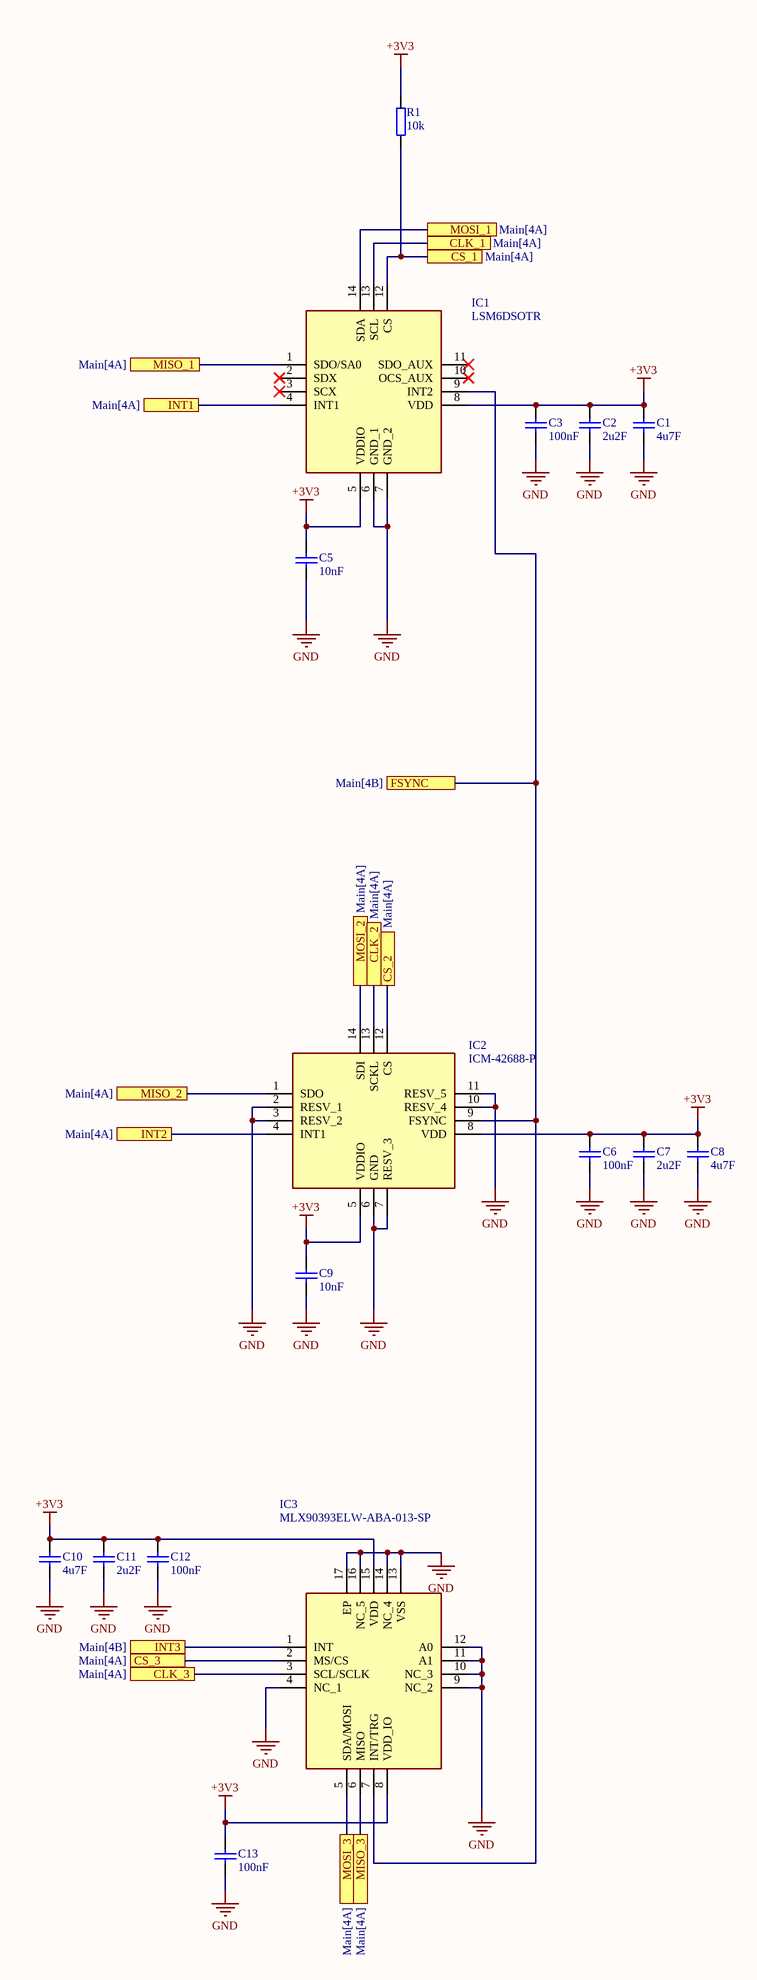
[diagram p3: IMU.SchDoc]

### Parts
C1  value 4u7F  [CAP0805]  (hidden comment: Cap0805)
C2  value 2u2F  [CAP0603]  (hidden comment: Cap0603)
C3  value 100nF  [CAP0402]  (hidden comment: Cap0402)
C5  value 10nF  [CAP0402]  (hidden comment: Cap0402)
C6  value 100nF  [CAP0402]  (hidden comment: Cap0402)
C7  value 2u2F  [CAP0603]  (hidden comment: Cap0603)
C8  value 4u7F  [CAP0805]  (hidden comment: Cap0805)
C9  value 10nF  [CAP0402]  (hidden comment: Cap0402)
C10  value 4u7F  [CAP0805]  (hidden comment: Cap0805)
C11  value 2u2F  [CAP0603]  (hidden comment: Cap0603)
C12  value 100nF  [CAP0402]  (hidden comment: Cap0402)
C13  value 100nF  [CAP0402]  (hidden comment: Cap0402)
IC1  LSM6DSOTR  [LSM6DS3USTR]
IC2  ICM-42688-P  [IIM42352]
IC3  MLX90393ELW-ABA-013-SP  [QFN50P300X300X100-17N-D]
R1  value 10k  [RES0402]  (hidden comment: Res0402)

### Ports
CLK_1 (see Main[4A]), CLK_2 (see Main[4A]), CLK_3 (see Main[4A]), CS_1 (see Main[4A]), CS_2 (see Main[4A]), CS_3 (see Main[4A]), FSYNC (see Main[4B]), INT1 (see Main[4A]), INT2 (see Main[4A]), INT3 (see Main[4B]), MISO_1 (see Main[4A]), MISO_2 (see Main[4A]), MISO_3 (see Main[4A]), MOSI_1 (see Main[4A]), MOSI_2 (see Main[4A]), MOSI_3 (see Main[4A])

### Nets
+3V3: C1.2 C2.2 C3.2 C5.2 C6.2 C7.2 C8.2 C9.2 C10.2 C11.2 C12.2 C13.2 IC1.5(VDDIO) IC1.8(VDD) IC2.5(VDDIO) IC2.8(VDD) IC3.8(VDD_IO) IC3.15(VDD) R1.2
GND: C1.1 C2.1 C3.1 C5.1 C6.1 C7.1 C8.1 C9.1 C10.1 C11.1 C12.1 C13.1 IC1.6(GND_1) IC1.7(GND_2) IC2.2(RESV_1) IC2.3(RESV_2) IC2.6(GND) IC2.7(RESV_3) IC2.10(RESV_4) IC2.11(RESV_5) IC3.4(NC_1) IC3.9(NC_2) IC3.10(NC_3) IC3.11(A1) IC3.12(A0) IC3.13(VSS) IC3.14(NC_4) IC3.16(NC_5) IC3.17(EP)
SPI1_MISO: IC1.1(SDO/SA0) ; port MISO_1
SPI1_MOSI: IC1.14(SDA) ; port MOSI_1
SPI1_SCK: IC1.13(SCL) ; port CLK_1
SPI5_MISO: IC3.6(MISO) ; port MISO_3
SPI5_MOSI: IC3.5(SDA/MOSI) ; port MOSI_3
SPI5_SCK: IC3.3(SCL/SCLK) ; port CLK_3
SPI6_MISO: IC2.1(SDO) ; port MISO_2
SPI6_MOSI: IC2.14(SDI) ; port MOSI_2
SPI6_SCK: IC2.13(SCKL) ; port CLK_2
NetIC1_4: IC1.4(INT1) ; port INT1
NetIC1_9: IC1.9(INT2) IC2.9(FSYNC) IC3.7(INT/TRG) ; port FSYNC
NetIC1_12: IC1.12(CS) R1.1 ; port CS_1
NetIC2_4: IC2.4(INT1) ; port INT2
NetIC2_12: IC2.12(CS) ; port CS_2
NetIC3_1: IC3.1(INT) ; port INT3
NetIC3_2: IC3.2(MS/CS) ; port CS_3

Not connected (* = marked no-connect by the designer): IC1 2(SDX)* 3(SCX)* 10(OCS_AUX)* 11(SDO_AUX)*

### Library data of the parts
C1 C8 C10 = Cap0805: Manufacturer_Part_Number: GRM21BR61H475ME51L; Voltage: 35V
C2 C7 C11 = Cap0603: as C24 on sheet MCU
C3 C6 C12 C13 = Cap0402: as C14 on sheet MCU
C5 C9 = Cap0402: Manufacturer_Part_Number: GRM155R71H103MA88D; Voltage: 50V
IC1 = LSM6DSOTR: Accelerometer; Manufacturer_Name: STMicroelectronics; Datasheet Link: https://www.st.com/resource/en/datasheet/lsm6dso.pdf; Height: 0.86mm; Manufacturer_Part_Number: LSM6DSOTR; Mouser Part Number: 511-LSM6DSOTR; Mouser Price/Stock: https://www.mouser.co.uk/ProductDetail/STMicroelectronics/LSM6DSOTR?qs=lc2O%252BfHJPVbD197C5c7oNw%3D%3D; Arrow Part Number: LSM6DSOTR; Arrow Price/Stock: https://www.arrow.com/en/products/lsm6dsotr/stmicroelectronics?utm_currency=USD&region=nac
IC2 = ICM-42688-P: Integrated Circuit; Manufacturer_Name: TDK; Datasheet Link: https://3cfeqx1hf82y3xcoull08ihx-wpengine.netdna-ssl.com/wp-content/uploads/2021/06/DS-000347-ICM-42688-P-v1.5.pdf; Manufacturer_Part_Number: ICM-42688-P; Mouser Part Number: 410-ICM-42688-P; Mouser Price/Stock: https://www.mouser.co.uk/ProductDetail/TDK-InvenSense/ICM-42688-P?qs=OlC7AqGiEDk8QrNAV728zw%3D%3D; Arrow Part Number: ICM-42688-P; Arrow Price/Stock: https://www.arrow.com/en/products/icm-42688-p/invensense?utm_currency=USD&region=nac
IC3 = MLX90393ELW-ABA-013-SP: Integrated Circuit; Manufacturer_Name: Melexis; Datasheet Link: https://www.melexis.com/-/media/files/documents/datasheets/mlx90393-datasheet-melexis.pdf; Height: 1mm; Manufacturer_Part_Number: MLX90393ELW-ABA-013-SP; Mouser Part Number: 482-90393ELWABA013SP; Mouser Price/Stock: https://www.mouser.co.uk/ProductDetail/Melexis/MLX90393ELW-ABA-013-SP?qs=4pzlT8jjbhe5W8hWOSw65g%3D%3D; Arrow Part Number: MLX90393ELW-ABA-013-SP; Arrow Price/Stock: https://www.arrow.com/en/products/mlx90393elw-aba-013-sp/melexis?utm_currency=USD&region=nac
R1 = Res0402: Manufacturer_Part_Number: ERA-2AED103X

## Sheet Flash.SchDoc
size A4; SheetNumber: 7; SheetTotal: 13
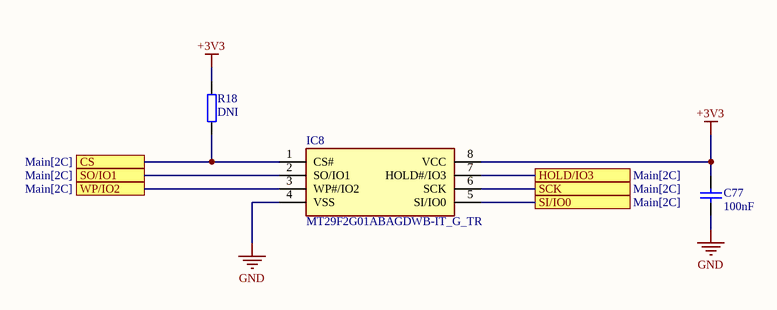
[diagram p4: Flash.SchDoc]

### Parts
C77  value 100nF  [CAP0402]  (hidden comment: Cap0402)
IC8  MT29F2G01ABAGDWB-IT_G_TR  [SON127P800X600X65-8N]
R18  value DNI  [RES0402]  (hidden comment: Res0402)

### Ports
CS (see Main[2C]), HOLD/IO3 (see Main[2C]), SCK (see Main[2C]), SI/IO0 (see Main[2C]), SO/IO1 (see Main[2C]), WP/IO2 (see Main[2C])

### Nets
+3V3: C77.2 IC8.8(VCC) R18.2
GND: C77.1 IC8.4(VSS)
NetIC4_37: IC8.3(WP#/IO2) ; port WP/IO2
NetIC4_42: IC8.7(HOLD#/IO3) ; port HOLD/IO3
NetIC4_46: IC8.2(SO/IO1) ; port SO/IO1
NetIC4_47: IC8.5(SI/IO0) ; port SI/IO0
NetIC4_48: IC8.6(SCK) ; port SCK
NetIC4_64: IC8.1(CS#) R18.1 ; port CS

### Library data of the parts
C77 = Cap0402: as C14 on sheet MCU
IC8 = MT29F2G01ABAGDWB-IT_G_TR: Integrated Circuit; Manufacturer_Name: Micron; Manufacturer_Part_Number: MT29F2G01ABAGDWB-IT:G TR; Datasheet Link: https://www.arrow.com/en/products/mt29f2g01abagdwb-itgtr/micron-technology; Height: 0.65mm; Mouser Part Number: 340-319922-REEL; Mouser Price/Stock: https://www.mouser.co.uk/ProductDetail/Micron/MT29F2G01ABAGDWB-ITG-TR?qs=j%252B1pi9TdxUa99FyONPZPSg%3D%3D; Arrow Part Number: MT29F2G01ABAGDWB-IT:G TR; Arrow Price/Stock: https://www.arrow.com/en/products/mt29f2g01abagdwb-itg-tr/micron-technology?region=nac

## Sheet GPS.SchDoc
size A4; SheetNumber: 8; SheetTotal: 13
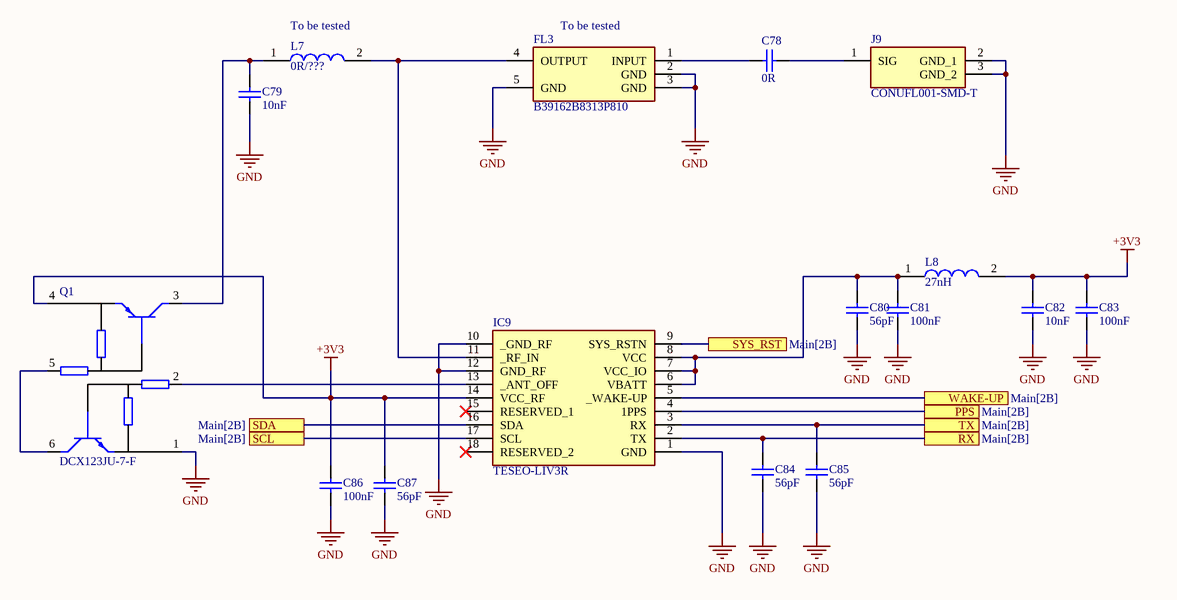
[diagram p5: GPS.SchDoc]

### Parts
C78  value 0R  [CAP0402]  (hidden comment: Cap0402)
C79  value 10nF  [CAP0402]  (hidden comment: Cap0402)
C80  value 56pF  [CAP0402]  (hidden comment: Cap0402)
C81  value 100nF  [CAP0402]  (hidden comment: Cap0402)
C82  value 10nF  [CAP0402]  (hidden comment: Cap0402)
C83  value 100nF  [CAP0402]  (hidden comment: Cap0402)
C84  value 56pF  [CAP0402]  (hidden comment: Cap0402)
C85  value 56pF  [CAP0402]  (hidden comment: Cap0402)
C86  value 100nF  [CAP0402]  (hidden comment: Cap0402)
C87  value 56pF  [CAP0402]  (hidden comment: Cap0402)
FL3  B39162B8313P810  [B39162B8313P810]
IC9  TESEO-LIV3R  [TESEOLIV3R]
J9  CONUFL001-SMD-T  [CONUFL001-SMD]
L7  value 0R/???  [INDC1005X55N]  (hidden comment: LQG15HS27NJ02)
L8  value 27nH  [INDC1005X55N]  (hidden comment: LQG15HS27NJ02)
Q1  DCX123JU-7-F  [SOT65P210X110-6N]

### Ports
PPS (see Main[2B]), RX (see Main[2B]), SCL (see Main[2B]), SDA (see Main[2B]), SYS_RST (see Main[2B]), TX (see Main[2B]), WAKE-UP (see Main[2B])

### Nets
+3V3: C82.2 C83.2 C86.2 C87.2 IC9.14(VCC_RF) L8.2 Q1.4(E)
GND: C79.1 C80.1 C81.1 C82.1 C83.1 C84.1 C85.1 C86.1 C87.1 FL3.2(GND) FL3.3(GND) FL3.5(GND) IC9.1(GND) IC9.10(_GND_RF) IC9.12(GND_RF) J9.2(GND_1) J9.3(GND_2) Q1.1(E)
NetC78_1: C78.1 J9.1(SIG)
NetC78_2: C78.2 FL3.1(INPUT)
NetC79_2: C79.2 L7.1 Q1.3(C)
NetC80_2: C80.2 C81.2 IC9.6(VBATT) IC9.7(VCC_IO) IC9.8(VCC) L8.1
NetC84_2: C84.2 IC9.2(TX) ; port RX
NetC85_2: C85.2 IC9.3(RX) ; port TX
NetFL3_4: FL3.4(OUTPUT) IC9.11(_RF_IN) L7.2
NetIC4_49: IC9.9(SYS_RSTN) ; port SYS_RST
NetIC4_50: IC9.5(_WAKE-UP) ; port WAKE-UP
NetIC9_4: IC9.4(1PPS) ; port PPS
NetIC9_13: IC9.13(_ANT_OFF) Q1.2(B)
NetIC9_16: IC9.16(SDA) ; port SDA
NetIC9_17: IC9.17(SCL) ; port SCL
NetQ1_5: Q1.5(B) Q1.6(C)

Not connected (* = marked no-connect by the designer): IC9 15(RESERVED_1)* 18(RESERVED_2)*

### Notes on the sheet
- (near L7) To be tested
- (near FL3) To be tested

### Library data of the parts
C78 = Cap0402: RF NP0
C79 = Cap0402: RF NP0; Manufacturer_Part_Number: GRM1555CYA103GE01D; Voltage: 50V
C80 C84 C85 C87 = Cap0402: Manufacturer_Part_Number: GCM1555C1H560GA16D; Voltage: 50V
C81 C83 C86 = Cap0402: as C14 on sheet MCU
C82 = Cap0402: as C5 on sheet IMU
FL3 = B39162B8313P810: Filter; Manufacturer_Name: RF360; Datasheet Link: https://4donline.ihs.com/images/VipMasterIC/IC/TDKC/TDKC-S-A0001073526/TDKC-S-A0001073105-1.pdf?hkey=52A5661711E402568146F3353EA87419; Height: 0.4mm; Manufacturer_Part_Number: B39162B8313P810; Mouser Part Number: N/A; Mouser Price/Stock: https://www.mouser.co.uk/ProductDetail/RF360/B39162B8313P810?qs=%2Fd%252BFzHvH4c20Rngavm5AuA%3D%3D
IC9 = TESEO-LIV3R: Integrated Circuit; Manufacturer_Name: STMicroelectronics; Datasheet Link: https://www.st.com/resource/en/datasheet/teseo-liv3r.pdf; Height: 2.3mm; Manufacturer_Part_Number: TESEO-LIV3R; Mouser Part Number: 511-TESEO-LIV3R; Mouser Price/Stock: https://www.mouser.co.uk/ProductDetail/STMicroelectronics/TESEO-LIV3R?qs=ZSypp649SOXG7EmhCFcBlw%3D%3D; Arrow Part Number: TESEO-LIV3R; Arrow Price/Stock: https://www.arrow.com/en/products/teseo-liv3r/stmicroelectronics?region=nac
J9 = CONUFL001-SMD-T: Connector; Manufacturer_Name: Linx Technologies; Datasheet Link: https://linxtechnologies.com/wp/product/mhf-rf-connectors/; Manufacturer_Part_Number: CONUFL001-SMD-T; Mouser Part Number: 712-CONUFL001-SMD-T; Mouser Price/Stock: https://www.mouser.co.uk/ProductDetail/Linx-Technologies/CONUFL001-SMD-T?qs=EU6FO9ffTwfRdkBeQTdJWQ%3D%3D
L7 L8 = LQG15HS27NJ02: Inductor; Manufacturer_Part_Number: LQG15HS27NJ02
Q1 = DCX123JU-7-F: Transistor BJT PNP; Manufacturer_Name: Diodes Incorporated; Datasheet Link: https://www.diodes.com//assets/Datasheets/DCX_XXXX_U.pdf; Height: 1.1mm; Manufacturer_Part_Number: DCX123JU-7-F; Mouser Part Number: 621-DCX123JU-F; Mouser Price/Stock: https://www.mouser.co.uk/ProductDetail/Diodes-Incorporated/DCX123JU-7-F?qs=JodRp68BO%2F64PTlIzh5LEQ%3D%3D; Arrow Part Number: DCX123JU-7-F; Arrow Price/Stock: https://www.arrow.com/en/products/dcx123ju-7-f/diodes-incorporated

## Sheet Barometer.SchDoc
size A4; SheetNumber: 9; SheetTotal: 13
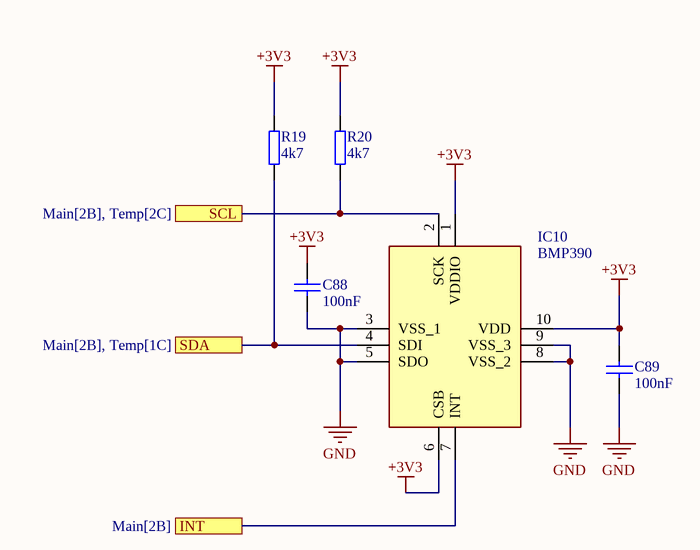
[diagram p6: Barometer.SchDoc]

### Parts
C88  value 100nF  [CAP0402]  (hidden comment: Cap0402)
C89  value 100nF  [CAP0402]  (hidden comment: Cap0402)
IC10  BMP390  [BMP390]
R19  value 4k7  [RES0402]  (hidden comment: Res0402)
R20  value 4k7  [RES0402]  (hidden comment: Res0402)

### Ports
INT (see Main[2B]), SCL (see Main[2B], Temp[2C]), SDA (see Main[2B], Temp[1C])

### Nets
+3V3: C88.2 C89.2 IC10.1(VDDIO) IC10.6(CSB) IC10.10(VDD) R19.2 R20.2
GND: C88.1 C89.1 IC10.3(VSS_1) IC10.5(SDO) IC10.8(VSS_2) IC10.9(VSS_3)
NetIC4_54: IC10.2(SCK) R20.1 ; port SCL
NetIC4_55: IC10.4(SDI) R19.1 ; port SDA
NetIC4_75: IC10.7(INT) ; port INT

### Library data of the parts
C88 C89 = Cap0402: as C14 on sheet MCU
IC10 = BMP390: Integrated Circuit; Manufacturer_Name: BOSCH; Datasheet Link: https://www.bosch-sensortec.com/media/boschsensortec/downloads/datasheets/bst-bmp390-ds002.pdf; Height: 0.8mm; Manufacturer_Part_Number: BMP390; Mouser Part Number: 262-BMP390; Mouser Price/Stock: https://www.mouser.co.uk/ProductDetail/Bosch-Sensortec/BMP390?qs=QNEnbhJQKvYQVfvRMgo2YA%3D%3D; Arrow Part Number: BMP390; Arrow Price/Stock: https://www.arrow.com/en/products/bmp390/bosch?region=nac
R19 R20 = Res0402: Manufacturer_Part_Number: RC0402JR-7W4K7L

## Sheet LED.SchDoc
size A4; SheetNumber: 10; SheetTotal: 13
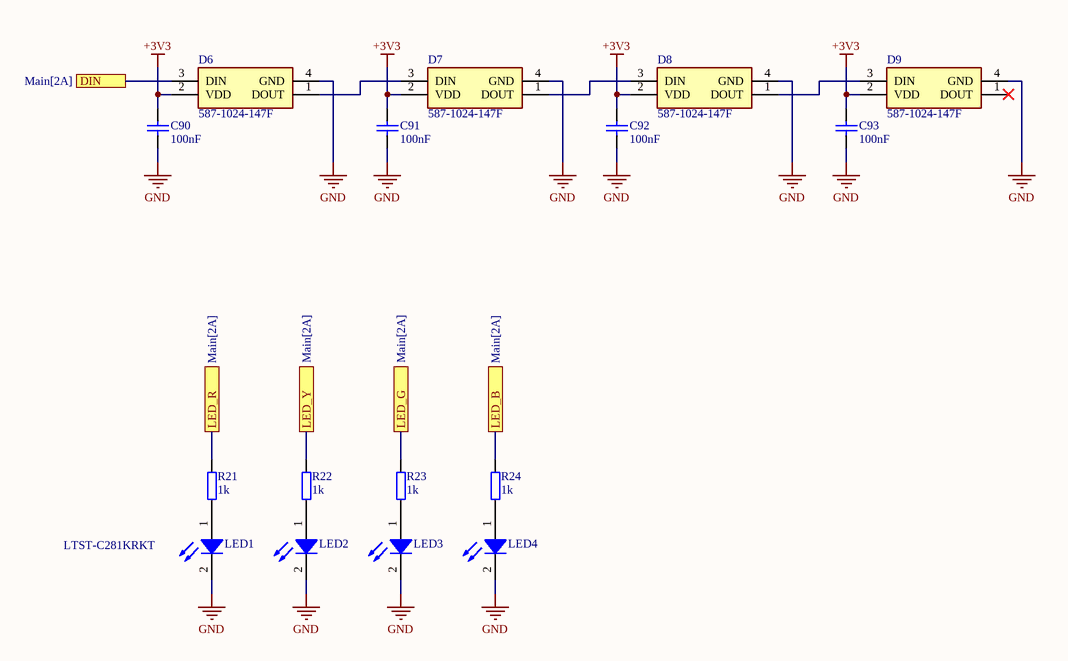
[diagram p7: LED.SchDoc]

### Parts
C90  value 100nF  [CAP0402]  (hidden comment: Cap0402)
C91  value 100nF  [CAP0402]  (hidden comment: Cap0402)
C92  value 100nF  [CAP0402]  (hidden comment: Cap0402)
C93  value 100nF  [CAP0402]  (hidden comment: Cap0402)
D6  587-1024-147F  [5871024147F]
D7  587-1024-147F  [5871024147F]
D8  587-1024-147F  [5871024147F]
D9  587-1024-147F  [5871024147F]
LED1  LTST-C281KRKT  [LTSTC281KRKT]
LED2  LTST-C281KSKT  [LTSTC281KRKT]  (value not drawn)
LED3  LTST-C281KGKT  [LTSTC281KRKT]  (value not drawn)
LED4  LTST-C281KBKT  [LTSTC281KRKT]  (value not drawn)
R21  value 1k  [RES0402]  (hidden comment: Res0402)
R22  value 1k  [RES0402]  (hidden comment: Res0402)
R23  value 1k  [RES0402]  (hidden comment: Res0402)
R24  value 1k  [RES0402]  (hidden comment: Res0402)

### Ports
DIN (see Main[2A]), LED_B (see Main[2A]), LED_G (see Main[2A]), LED_R (see Main[2A]), LED_Y (see Main[2A])

### Nets
+3V3: C90.2 C91.2 C92.2 C93.2 D6.2(VDD) D7.2(VDD) D8.2(VDD) D9.2(VDD)
GND: C90.1 C91.1 C92.1 C93.1 D6.4(GND) D7.4(GND) D8.4(GND) D9.4(GND) LED1.2(A) LED2.2(A) LED3.2(A) LED4.2(A)
NetD6_1: D6.1(DOUT) D7.3(DIN)
NetD6_3: D6.3(DIN) ; port DIN
NetD7_1: D7.1(DOUT) D8.3(DIN)
NetD8_1: D8.1(DOUT) D9.3(DIN)
NetIC4_99: R24.1 ; port LED_B
NetIC4_100: R23.1 ; port LED_G
NetIC4_101: R22.1 ; port LED_Y
NetIC4_102: R21.1 ; port LED_R
NetLED1_1: LED1.1(K) R21.2
NetLED2_1: LED2.1(K) R22.2
NetLED3_1: LED3.1(K) R23.2
NetLED4_1: LED4.1(K) R24.2

Not connected (* = marked no-connect by the designer): D9 1(DOUT)*

### Library data of the parts
C90-C93 = Cap0402: as C14 on sheet MCU
D6-D9 = 587-1024-147F: LED; Manufacturer_Name: Dialight; Datasheet Link: https://s3-us-west-2.amazonaws.com/catsy.557/Dialight_datasheet_587-1024-147F_Addressable_RGB.pdf; Height: 0.9mm; Manufacturer_Part_Number: 587-1024-147F
LED1-LED4 = LTST-C281KRKT: LED (Multiple); Manufacturer_Name: Lite-On; Datasheet Link: https://www.digikey.ph/en/products/detail/liteon/LTST-C281KRKT/3198723; Height: 0.35mm; Manufacturer_Part_Number: LTST-C281KRKT; Mouser Part Number: 859-LTST-C281KRKT; Mouser Price/Stock: https://www.mouser.co.uk/ProductDetail/Lite-On/LTST-C281KRKT?qs=xb8aMrBSZRKAPWJcmf%2F7XQ%3D%3D; Arrow Part Number: LTST-C281KRKT; Arrow Price/Stock: https://www.arrow.com/en/products/ltst-c281krkt/lite-on-technology?region=nac
R21-R24 = Res0402: Manufacturer_Part_Number: RC0402DR-071KL

## Sheet PB_Conn.SchDoc
size A4; SheetNumber: 11; SheetTotal: 13
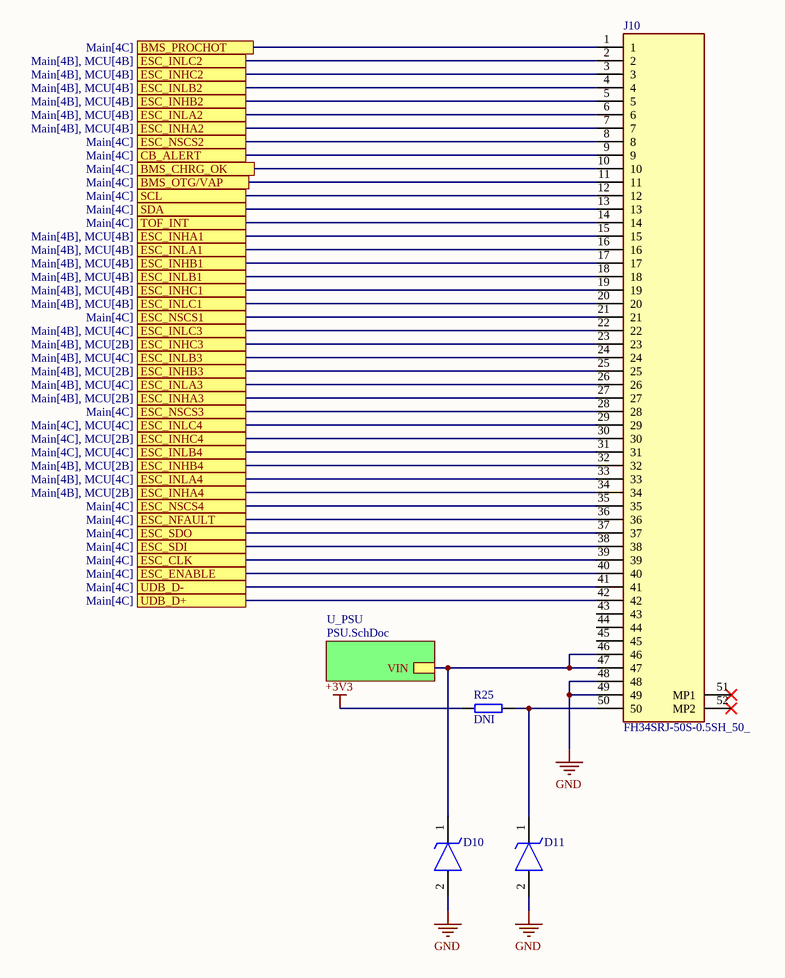
[diagram p8: PB_Conn.SchDoc]

### Parts
D10  DF2S24FS,L3M  [SODFL1006X45N]  (value not drawn)
D11  DF2S24FS,L3M  [SODFL1006X45N]  (value not drawn)
J10  FH34SRJ-50S-0.5SH_50_  [FH34SRJ50S05SH50]
R25  value DNI  [RES0402]  (hidden comment: Res0402)

### Sub-sheets
U_PSU = PSU.SchDoc: VIN

### Ports
BMS_CHRG_OK (see Main[4C]), BMS_OTG/VAP (see Main[4C]), BMS_PROCHOT (see Main[4C]), CB_ALERT (see Main[4C]), ESC_CLK (see Main[4C]), ESC_ENABLE (see Main[4C]), ESC_INHA1 (see Main[4B], MCU[4B]), ESC_INHA2 (see Main[4B], MCU[4B]), ESC_INHA3 (see Main[4B], MCU[2B]), ESC_INHA4 (see Main[4B], MCU[2B]), ESC_INHB1 (see Main[4B], MCU[4B]), ESC_INHB2 (see Main[4B], MCU[4B]), ESC_INHB3 (see Main[4B], MCU[2B]), ESC_INHB4 (see Main[4B], MCU[2B]), ESC_INHC1 (see Main[4B], MCU[4B]), ESC_INHC2 (see Main[4B], MCU[4B]), ESC_INHC3 (see Main[4B], MCU[2B]), ESC_INHC4 (see Main[4C], MCU[2B]), ESC_INLA1 (see Main[4B], MCU[4B]), ESC_INLA2 (see Main[4B], MCU[4B]), ESC_INLA3 (see Main[4B], MCU[4C]), ESC_INLA4 (see Main[4B], MCU[4C]), ESC_INLB1 (see Main[4B], MCU[4B]), ESC_INLB2 (see Main[4B], MCU[4B]), ESC_INLB3 (see Main[4B], MCU[4C]), ESC_INLB4 (see Main[4C], MCU[4C]), ESC_INLC1 (see Main[4B], MCU[4B]), ESC_INLC2 (see Main[4B], MCU[4B]), ESC_INLC3 (see Main[4B], MCU[4C]), ESC_INLC4 (see Main[4C], MCU[4C]), ESC_NFAULT (see Main[4C]), ESC_NSCS1 (see Main[4C]), ESC_NSCS2 (see Main[4C]), ESC_NSCS3 (see Main[4C]), ESC_NSCS4 (see Main[4C]), ESC_SDI (see Main[4C]), ESC_SDO (see Main[4C]), SCL (see Main[4C]), SDA (see Main[4C]), TOF_INT (see Main[4C]), UDB_D+ (see Main[4C]), UDB_D- (see Main[4C])

### Nets
+3V3: R25.2
GND: D10.2(A) D11.2(A) J10.48 J10.49
NetC56_1: D10.1(K) J10.46 J10.47 ; sheet U_PSU/VIN
NetD11_1: D11.1(K) J10.50 R25.1
NetIC4_10: J10.23 ; port ESC_INHC3
NetIC4_11: J10.25 ; port ESC_INHB3
NetIC4_12: J10.27 ; port ESC_INHA3
NetIC4_28: J10.37 ; port ESC_SDO
NetIC4_29: J10.38 ; port ESC_SDI
NetIC4_34: J10.30 ; port ESC_INHC4
NetIC4_35: J10.32 ; port ESC_INHB4
NetIC4_36: J10.34 ; port ESC_INHA4
NetIC4_45: J10.36 ; port ESC_NFAULT
NetIC4_53: J10.40 ; port ESC_ENABLE
NetIC4_58: J10.35 ; port ESC_NSCS4
NetIC4_59: J10.33 ; port ESC_INLA4
NetIC4_60: J10.31 ; port ESC_INLB4
NetIC4_63: J10.29 ; port ESC_INLC4
NetIC4_65: J10.28 ; port ESC_NSCS3
NetIC4_66: J10.26 ; port ESC_INLA3
NetIC4_67: J10.24 ; port ESC_INLB3
NetIC4_68: J10.22 ; port ESC_INLC3
NetIC4_69: J10.12 ; port SCL
NetIC4_70: J10.13 ; port SDA
NetIC4_73: J10.21 ; port ESC_NSCS1
NetIC4_74: J10.39 ; port ESC_CLK
NetIC4_76: J10.16 ; port ESC_INLA1
NetIC4_77: J10.18 ; port ESC_INLB1
NetIC4_78: J10.11 ; port BMS_OTG/VAP
NetIC4_79: J10.20 ; port ESC_INLC1
NetIC4_80: J10.8 ; port ESC_NSCS2
NetIC4_81: J10.19 ; port ESC_INHC1
NetIC4_82: J10.17 ; port ESC_INHB1
NetIC4_85: J10.15 ; port ESC_INHA1
NetIC4_86: J10.1 ; port BMS_PROCHOT
NetIC4_87: J10.14 ; port TOF_INT
NetIC4_88: J10.2 ; port ESC_INLC2
NetIC4_89: J10.4 ; port ESC_INLB2
NetIC4_90: J10.6 ; port ESC_INLA2
NetIC4_92: J10.10 ; port BMS_CHRG_OK
NetIC4_93: J10.9 ; port CB_ALERT
NetIC4_96: J10.7 ; port ESC_INHA2
NetIC4_97: J10.5 ; port ESC_INHB2
NetIC4_98: J10.3 ; port ESC_INHC2
NetIC4_103: J10.41 ; port UDB_D-
NetIC4_104: J10.42 ; port UDB_D+

Not connected (* = marked no-connect by the designer): J10 43 44 45 51(MP1)* 52(MP2)*

### Notes on the sheet
- (near R25) Each ESC can output 30mA, PB schould be able to sustain itself

### Library data of the parts
D10 D11 = DF2S24FS,L3M: TVS Diode (Uni-directional); Manufacturer_Name: Toshiba; Datasheet Link: https://www.mouser.com/datasheet/2/408/DF2S24FS_datasheet_en_20140718-708374.pdf; Height: 0.45mm; Manufacturer_Part_Number: DF2S24FS,L3M; Mouser Part Number: 757-DF2S24FSL3M; Mouser Price/Stock: https://www.mouser.co.uk/ProductDetail/Toshiba/DF2S24FSL3M?qs=lhkzy8lC%252BSvG2umxl0FuEw%3D%3D; Arrow Part Number: DF2S24FS,L3M; Arrow Price/Stock: https://www.arrow.com/en/products/df2s24fsl3m/toshiba?region=nac
J10 = FH34SRJ-50S-0.5SH_50_: Connector; Manufacturer_Name: Hirose; Manufacturer_Part_Number: FH34SRJ-50S-0.5SH(50); Datasheet Link: https://www.hirose.com/en/product/document?clcode=CL0580-1266-2-50&productname=FH34SRJ-50S-0.5SH(50)&series=FH34SRJ&documenttype=2DDrawing&lang=en&documentid=0001483059; Height: 1.75mm; Mouser Part Number: 798-FH34SRJ50S05SH50; Mouser Price/Stock: https://www.mouser.co.uk/ProductDetail/Hirose-Connector/FH34SRJ-50S-0.5SH50?qs=vcbW%252B4%252BSTIrLLD%2F8H%2F%252B%2Fhg%3D%3D; System: Connector

## Sheet PSU.SchDoc
size A3; SheetNumber: 12; SheetTotal: 13
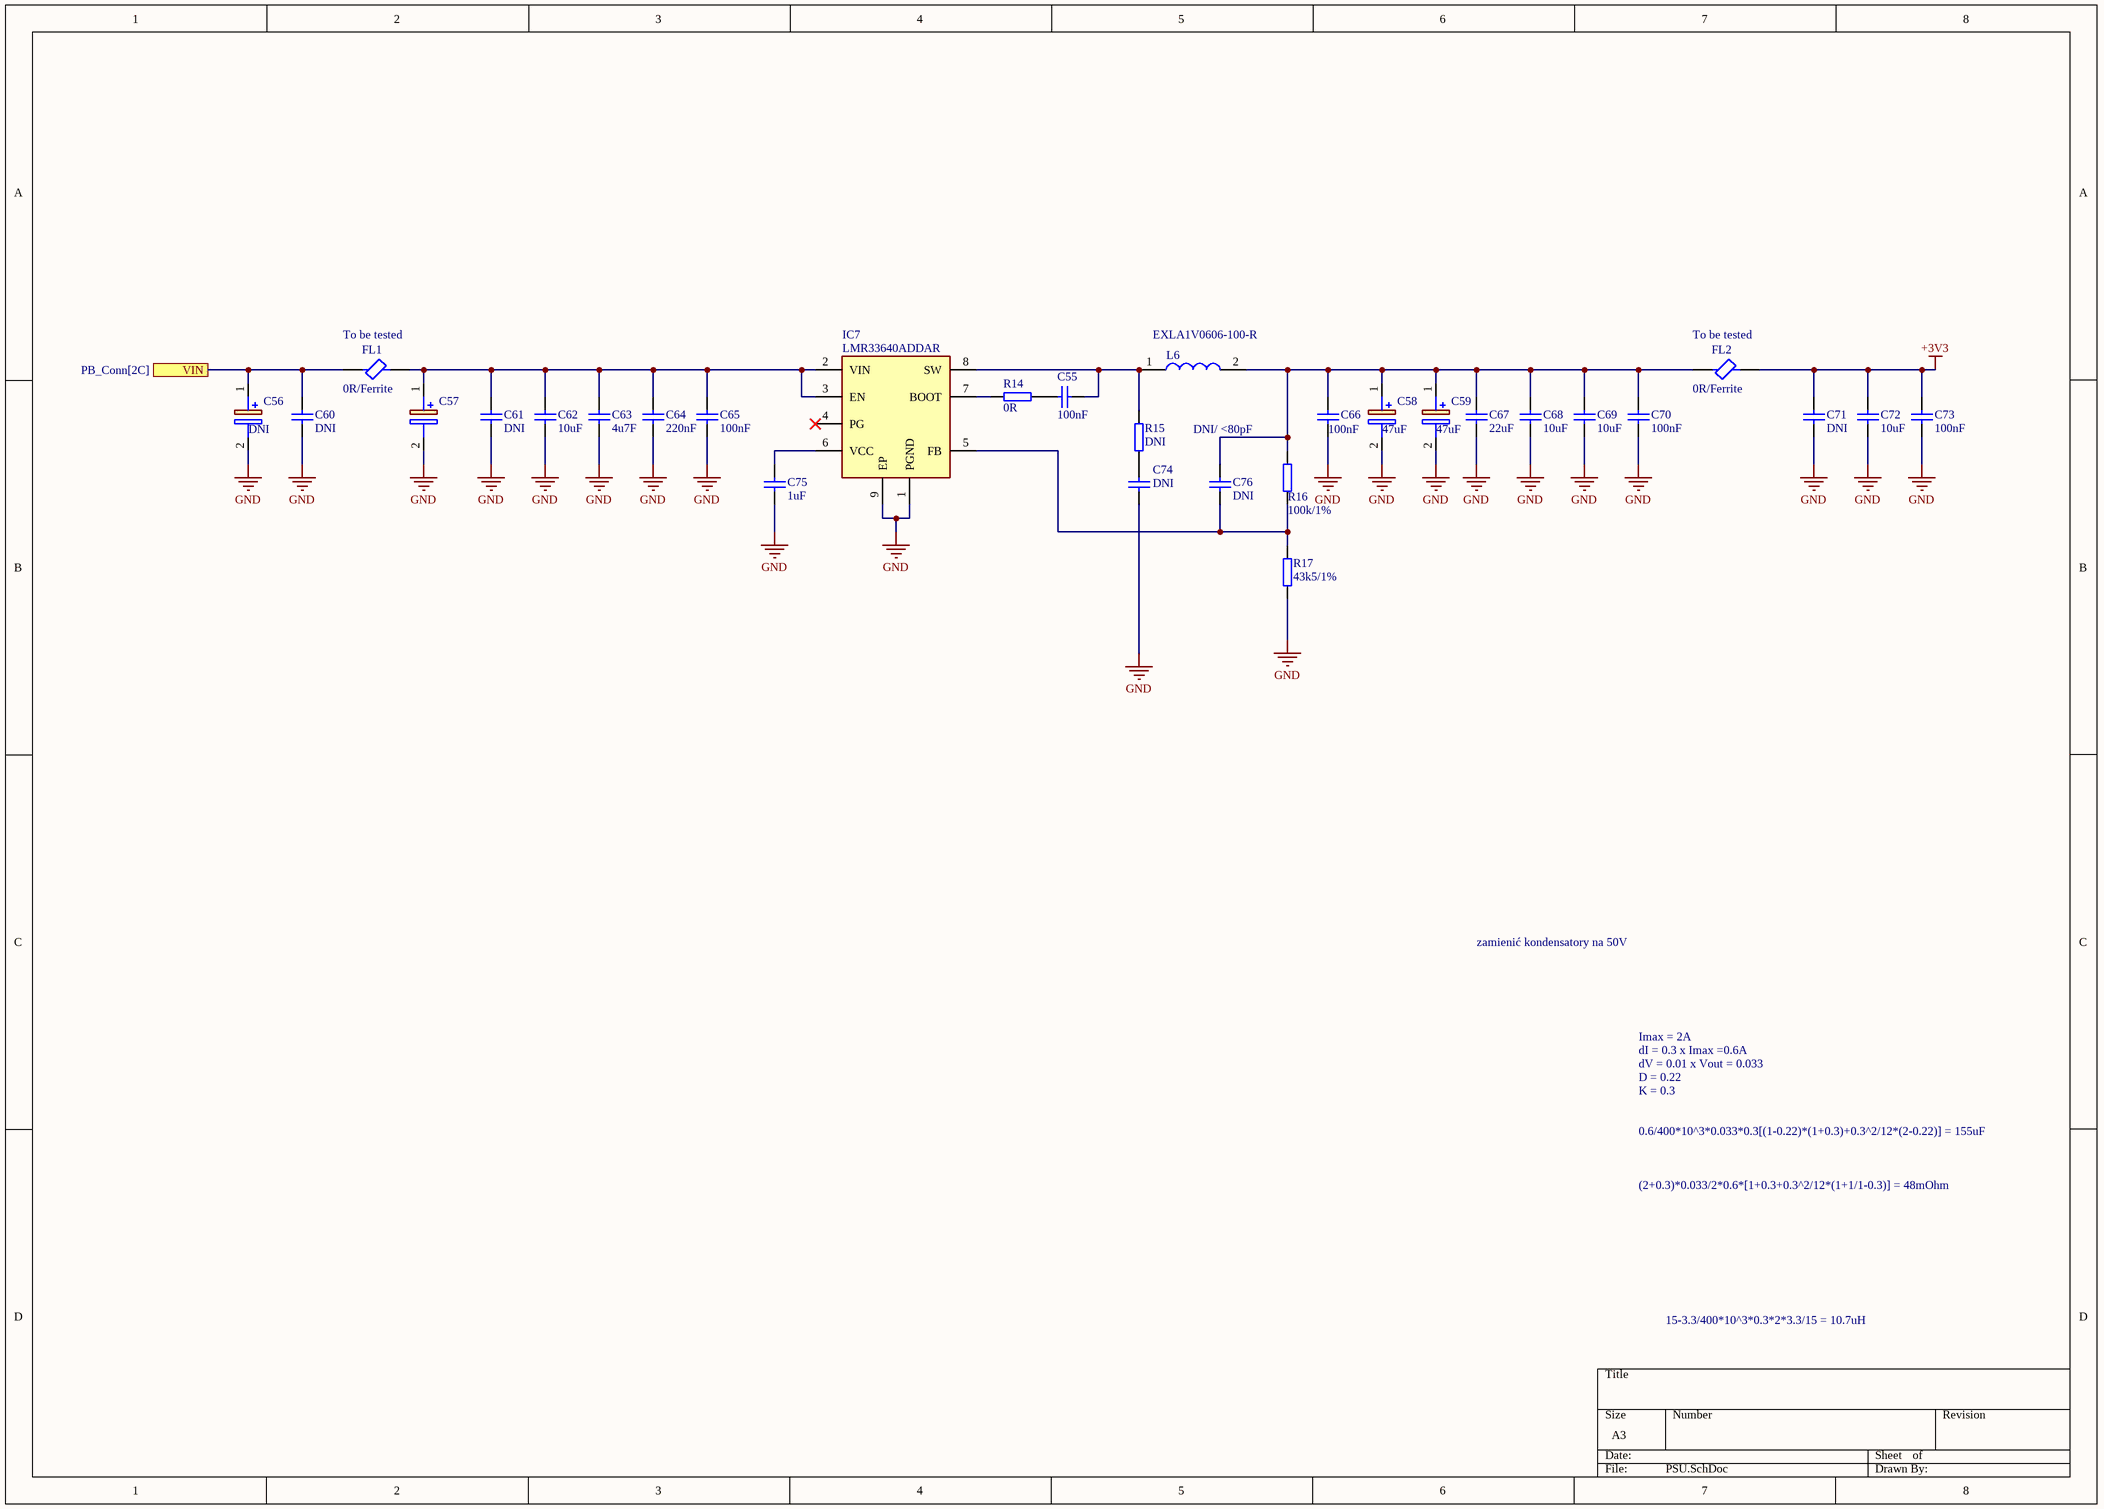
[diagram p9: PSU.SchDoc]

### Parts
C55  value 100nF  [CAP0402]  (hidden comment: Cap0402)
C56  value DNI  [CAPPM7343X310N]  (hidden comment: TR3D336K025D0200)
C57  TR3D336K025D0200  [CAPPM7343X310N]  (value not drawn)
C58  value 47uF  [CAPPC2012X90N]  (hidden comment: T58W9476M6R3C0200)
C59  value 47uF  [CAPPC2012X90N]  (hidden comment: T58W9476M6R3C0200)
C60  value DNI  [CAP0805]  (hidden comment: Cap0805)
C61  value DNI  [CAP0805]  (hidden comment: Cap0805)
C62  value 10uF  [CAP0805]  (hidden comment: Cap0805)
C63  value 4u7F  [CAP0805]  (hidden comment: Cap0805)
C64  value 220nF  [CAP0402]  (hidden comment: Cap0402)
C65  value 100nF  [CAP0402]  (hidden comment: Cap0402)
C66  value 100nF  [CAP0402]  (hidden comment: Cap0402)
C67  value 22uF  [CAP0805]  (hidden comment: Cap0805)
C68  value 10uF  [CAP0603]  (hidden comment: Cap0603)
C69  value 10uF  [CAP0603]  (hidden comment: Cap0603)
C70  value 100nF  [CAP0402]  (hidden comment: Cap0402)
C71  value DNI  [CAP0805]  (hidden comment: Cap0805)
C72  value 10uF  [CAP0603]  (hidden comment: Cap0603)
C73  value 100nF  [CAP0402]  (hidden comment: Cap0402)
C74  value DNI  [CAP0402]  (hidden comment: Cap0402)
C75  value 1uF  [CAP0402]  (hidden comment: Cap0402)
C76  value DNI  [CAP0402]  (hidden comment: Cap0402)
FL1  0R/Ferrite  [BLM31KN102BH1L]
FL2  0R/Ferrite  [BLM31KN102BH1L]
IC7  LMR33640ADDAR  [SOIC127P600X170-9N]
L6  EXLA1V0606-100-R  [EXLA1V0606100R]
R14  value 0R  [RES0402]  (hidden comment: Res0402)
R15  value DNI  [RES0402]  (hidden comment: Res0402)
R16  value 100k/1%  [RES0402]  (hidden comment: Res0402)
R17  value 43k5/1%  [RES0402]  (hidden comment: Res0402)

### Ports
VIN (see PB_Conn[2C])

### Nets
+3V3: C71.2 C72.2 C73.2 FL2.2
GND: C56.2(-) C57.2(-) C58.2(-) C59.2(-) C60.1 C61.1 C62.1 C63.1 C64.1 C65.1 C66.1 C67.1 C68.1 C69.1 C70.1 C71.1 C72.1 C73.1 C74.2 C75.1 IC7.1(PGND) IC7.9(EP) R17.1
NetC55_1: C55.1 R14.2
NetC55_2: C55.2 IC7.8(SW) L6.1 R15.1
NetC56_1: C56.1(+) C60.2 FL1.1 ; port VIN
NetC57_1: C57.1(+) C61.2 C62.2 C63.2 C64.2 C65.2 FL1.2 IC7.2(VIN) IC7.3(EN)
NetC58_1: C58.1(+) C59.1(+) C66.2 C67.2 C68.2 C69.2 C70.2 C76.2 FL2.1 L6.2 R16.2
NetC74_1: C74.1 R15.2
NetC75_2: C75.2 IC7.6(VCC)
NetC76_1: C76.1 IC7.5(FB) R16.1 R17.2
NetIC7_7: IC7.7(BOOT) R14.1

Not connected (* = marked no-connect by the designer): IC7 4(PG)*

### Notes on the sheet
- (near FL1) To be tested
- (near FL2) To be tested
- DNI/ <80pF
- zamienić kondensatory na 50V
- dI = 0.3 x Imax =0.6A
- Imax = 2A
- dV = 0.01 x Vout = 0.033
- K = 0.3
- D = 0.22
- 0.6/400*10^3*0.033*0.3[(1-0.22)*(1+0.3)+0.3^2/12*(2-0.22)] = 155uF
- (2+0.3)*0.033/2*0.6*[1+0.3+0.3^2/12*(1+1/1-0.3)] = 48mOhm
- 15-3.3/400*10^3*0.3*2*3.3/15 = 10.7uH

### Library data of the parts
C55 C66 C70 C73 = Cap0402: Manufacturer_Part_Number: GRM155R71H104ME14D; Voltage: 25V
C56 = TR3D336K025D0200: Capacitor Polarised; Voltage: DNI
C57 = TR3D336K025D0200: Capacitor Polarised; Manufacturer_Name: Vishay; Value: 33uF; Datasheet Link: http://www.vishay.com/doc?40080; Height: 3.1mm; Manufacturer_Part_Number: TR3D336K025D0200; Mouser Part Number: 74-TR3D336K025D0200; Mouser Price/Stock: https://www.mouser.com/Search/Refine.aspx?Keyword=74-TR3D336K025D0200
C58 C59 = T58W9476M6R3C0200: Capacitor Polarised; Voltage: 6V3; Manufacturer_Part_Number: T58W9476M6R3C0200
C60 C61 = Cap0805: Voltage: 35V
C62 = Cap0805: Manufacturer_Part_Number: GRM21BR61H106KE43K; Voltage: 35V
C63 = Cap0805: as C1 on sheet IMU
C64 = Cap0402: Manufacturer_Part_Number: GRM155R61H224ME01W; Voltage: 35V
C65 = Cap0402: Manufacturer_Part_Number: GRM155R71H104ME14D; Voltage: 35V
C67 = Cap0805: Manufacturer_Part_Number: CL21A226MAYNNNE; Voltage: 25V
C68 C69 C72 = Cap0603: Manufacturer_Part_Number: GRM188R61E106MA73J; Voltage: 25V
C75 = Cap0402: Manufacturer_Part_Number: GRM155R61H105KE05J; Voltage: 35V
FL1 FL2 = BLM31KN121SH1L: Filter
IC7 = LMR33640ADDAR: Integrated Circuit; Manufacturer_Name: Texas Instruments; Datasheet Link: https://www.ti.com/lit/gpn/LMR33640; Height: 1.7mm; Manufacturer_Part_Number: LMR33640ADDAR; Arrow Part Number: LMR33640ADDAR; Arrow Price/Stock: https://www.arrow.com/en/products/lmr33640addar/texas-instruments
L6 = EXLA1V0606-100-R: Inductor; Manufacturer_Name: Eaton; Datasheet Link: https://www.eaton.com/content/dam/eaton/products/electronic-components/resources/data-sheet/eaton-exla1v06-automotive-high-current-molded-inductor-data-sheet-elx1221-en.pdf; Height: 6mm; Manufacturer_Part_Number: EXLA1V0606-100-R; Mouser Part Number: 704-EXLA1V0606-100-R; Mouser Price/Stock: https://www.mouser.co.uk/ProductDetail/Bussmann-Eaton/EXLA1V0606-100-R?qs=T%252BzbugeAwjhRVU8Dylvhsg%3D%3D
R14 = Res0402: as R3 on sheet MCU
R16 = Res0402: Manufacturer_Part_Number: RC0402JR-13100KL
R17 = Res0402: Manufacturer_Part_Number: ERA-2AEB4322X
C71 = Cap0805: Voltage: DNI
C74 C76 = Cap0402: Voltage: DNI

## Sheet Temp.SchDoc
size A4; SheetNumber: 13; SheetTotal: 13
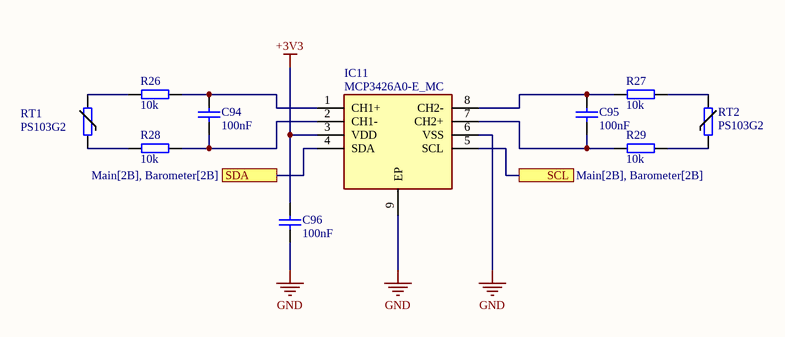
[diagram p10: Temp.SchDoc]

### Parts
C94  value 100nF  [CAP0402]  (hidden comment: Cap0402)
C95  value 100nF  [CAP0402]  (hidden comment: Cap0402)
C96  value 100nF  [CAP0402]  (hidden comment: Cap0402)
IC11  MCP3426A0-E_MC  [SON50P300X200X100-9N-D]
R26  value 10k  [RES0402]  (hidden comment: Res0402)
R27  value 10k  [RES0402]  (hidden comment: Res0402)
R28  value 10k  [RES0402]  (hidden comment: Res0402)
R29  value 10k  [RES0402]  (hidden comment: Res0402)
RT1  PS103G2  [PS103G2]
RT2  PS103G2  [PS103G2]

### Ports
SCL (see Main[2B], Barometer[2B]), SDA (see Main[2B], Barometer[2B])

### Nets
+3V3: C96.2 IC11.3(VDD)
GND: C96.1 IC11.6(VSS) IC11.9(EP)
NetC94_1: C94.1 IC11.2(CH1-) R28.1
NetC94_2: C94.2 IC11.1(CH1+) R26.1
NetC95_1: C95.1 IC11.7(CH2+) R29.1
NetC95_2: C95.2 IC11.8(CH2-) R27.1
NetIC4_54: IC11.5(SCL) ; port SCL
NetIC4_55: IC11.4(SDA) ; port SDA
NetR26_2: R26.2 RT1.2
NetR27_2: R27.2 RT2.2
NetR28_2: R28.2 RT1.1
NetR29_2: R29.2 RT2.1

### Library data of the parts
C94-C96 = Cap0402: as C14 on sheet MCU
IC11 = MCP3426A0-E_MC: Integrated Circuit; Manufacturer_Name: Microchip; Manufacturer_Part_Number: MCP3426A0-E/MC; Datasheet Link: http://www.microchip.com/mymicrochip/filehandler.aspx?ddocname=en546216; Height: 1mm; Mouser Part Number: 579-MCP3426A0E/MC; Mouser Price/Stock: https://www.mouser.co.uk/ProductDetail/Microchip-Technology/MCP3426A0-E-MC?qs=icxrp76fIjCY1JH54pALjQ%3D%3D; Arrow Part Number: MCP3426A0-E/MC; Arrow Price/Stock: https://www.arrow.com/en/products/mcp3426a0-emc/microchip-technology?region=nac
R26-R29 = Res0402: Manufacturer_Part_Number: ERA-2AED103X
RT1 RT2 = PS103G2: Thermistor; Manufacturer_Name: LITTELFUSE; Datasheet Link: https://componentsearchengine.com/Datasheets/1/PS103G2.pdf; Height: 2.413mm; Manufacturer_Part_Number: PS103G2; Mouser Part Number: 803-PS103G2; Mouser Price/Stock: https://www.mouser.co.uk/ProductDetail/Littelfuse/PS103G2?qs=gGwQ3tp6HcSgjlOXbgIaWw%3D%3D; Arrow Part Number: PS103G2; Arrow Price/Stock: https://www.arrow.com/en/products/ps103g2/littelfuse